# Altium schematic sheet Top_Level.SchDoc (part 1 of 2)
size 1651 x 1270 mm
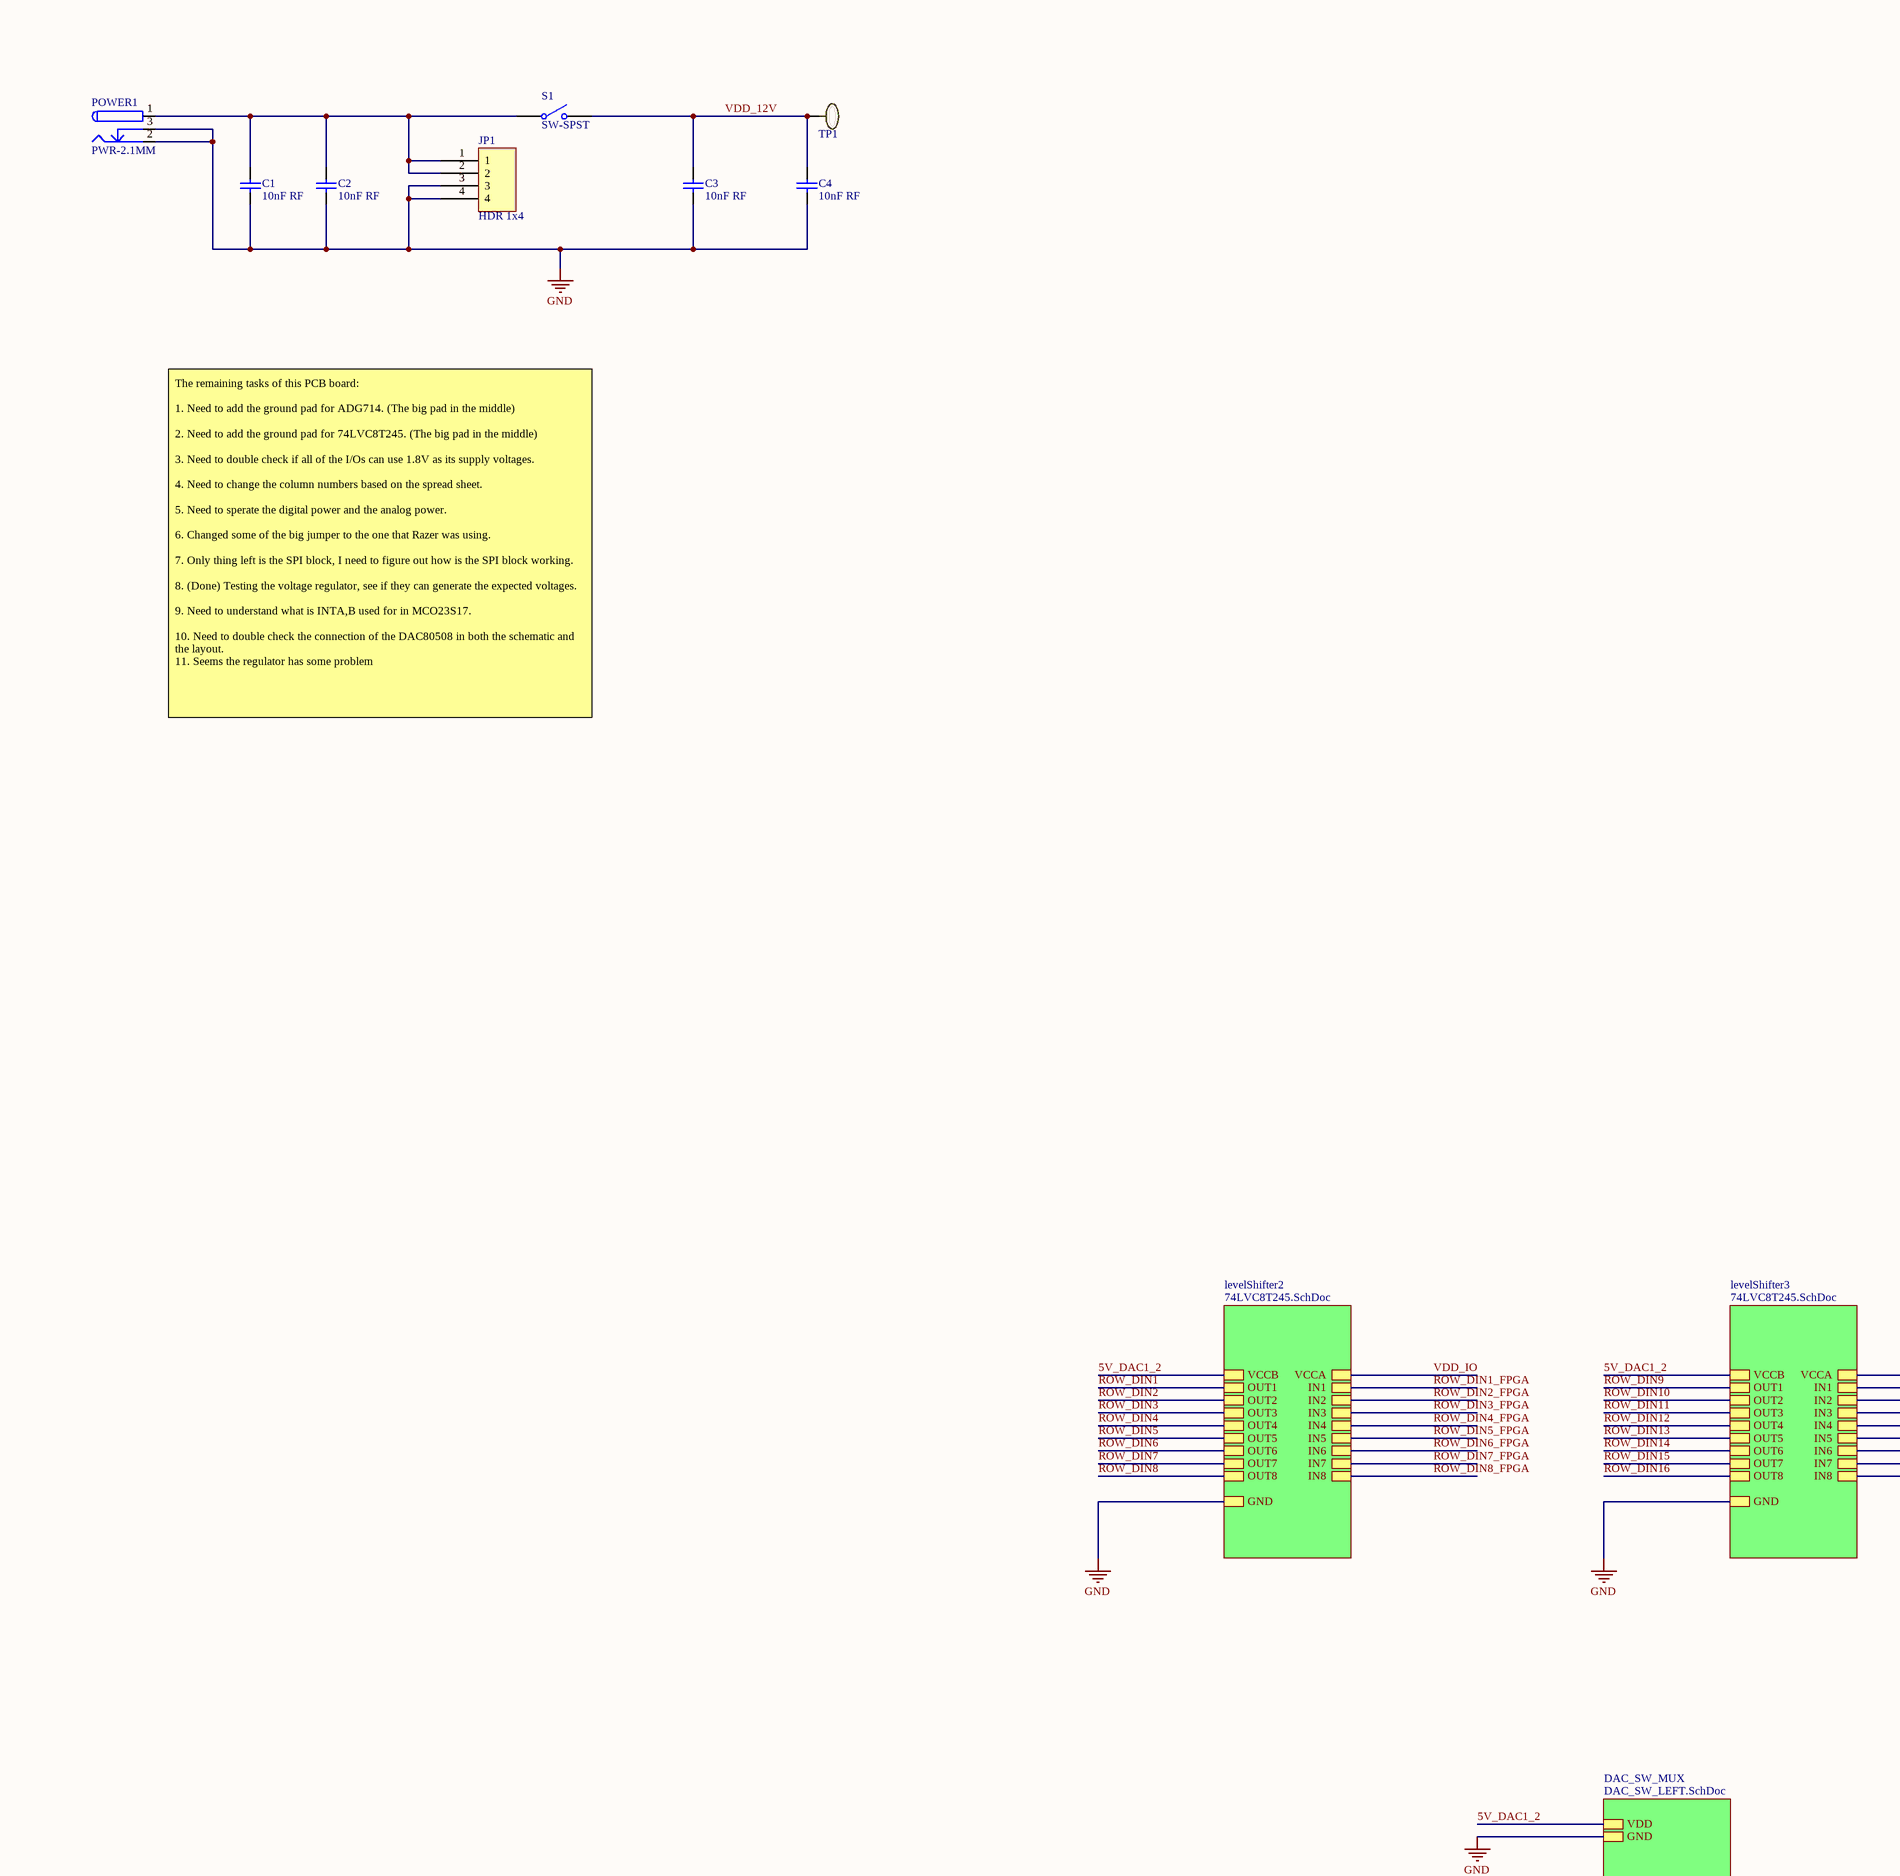
[diagram p0: Top_Level.SchDoc, top column 1 of 4]
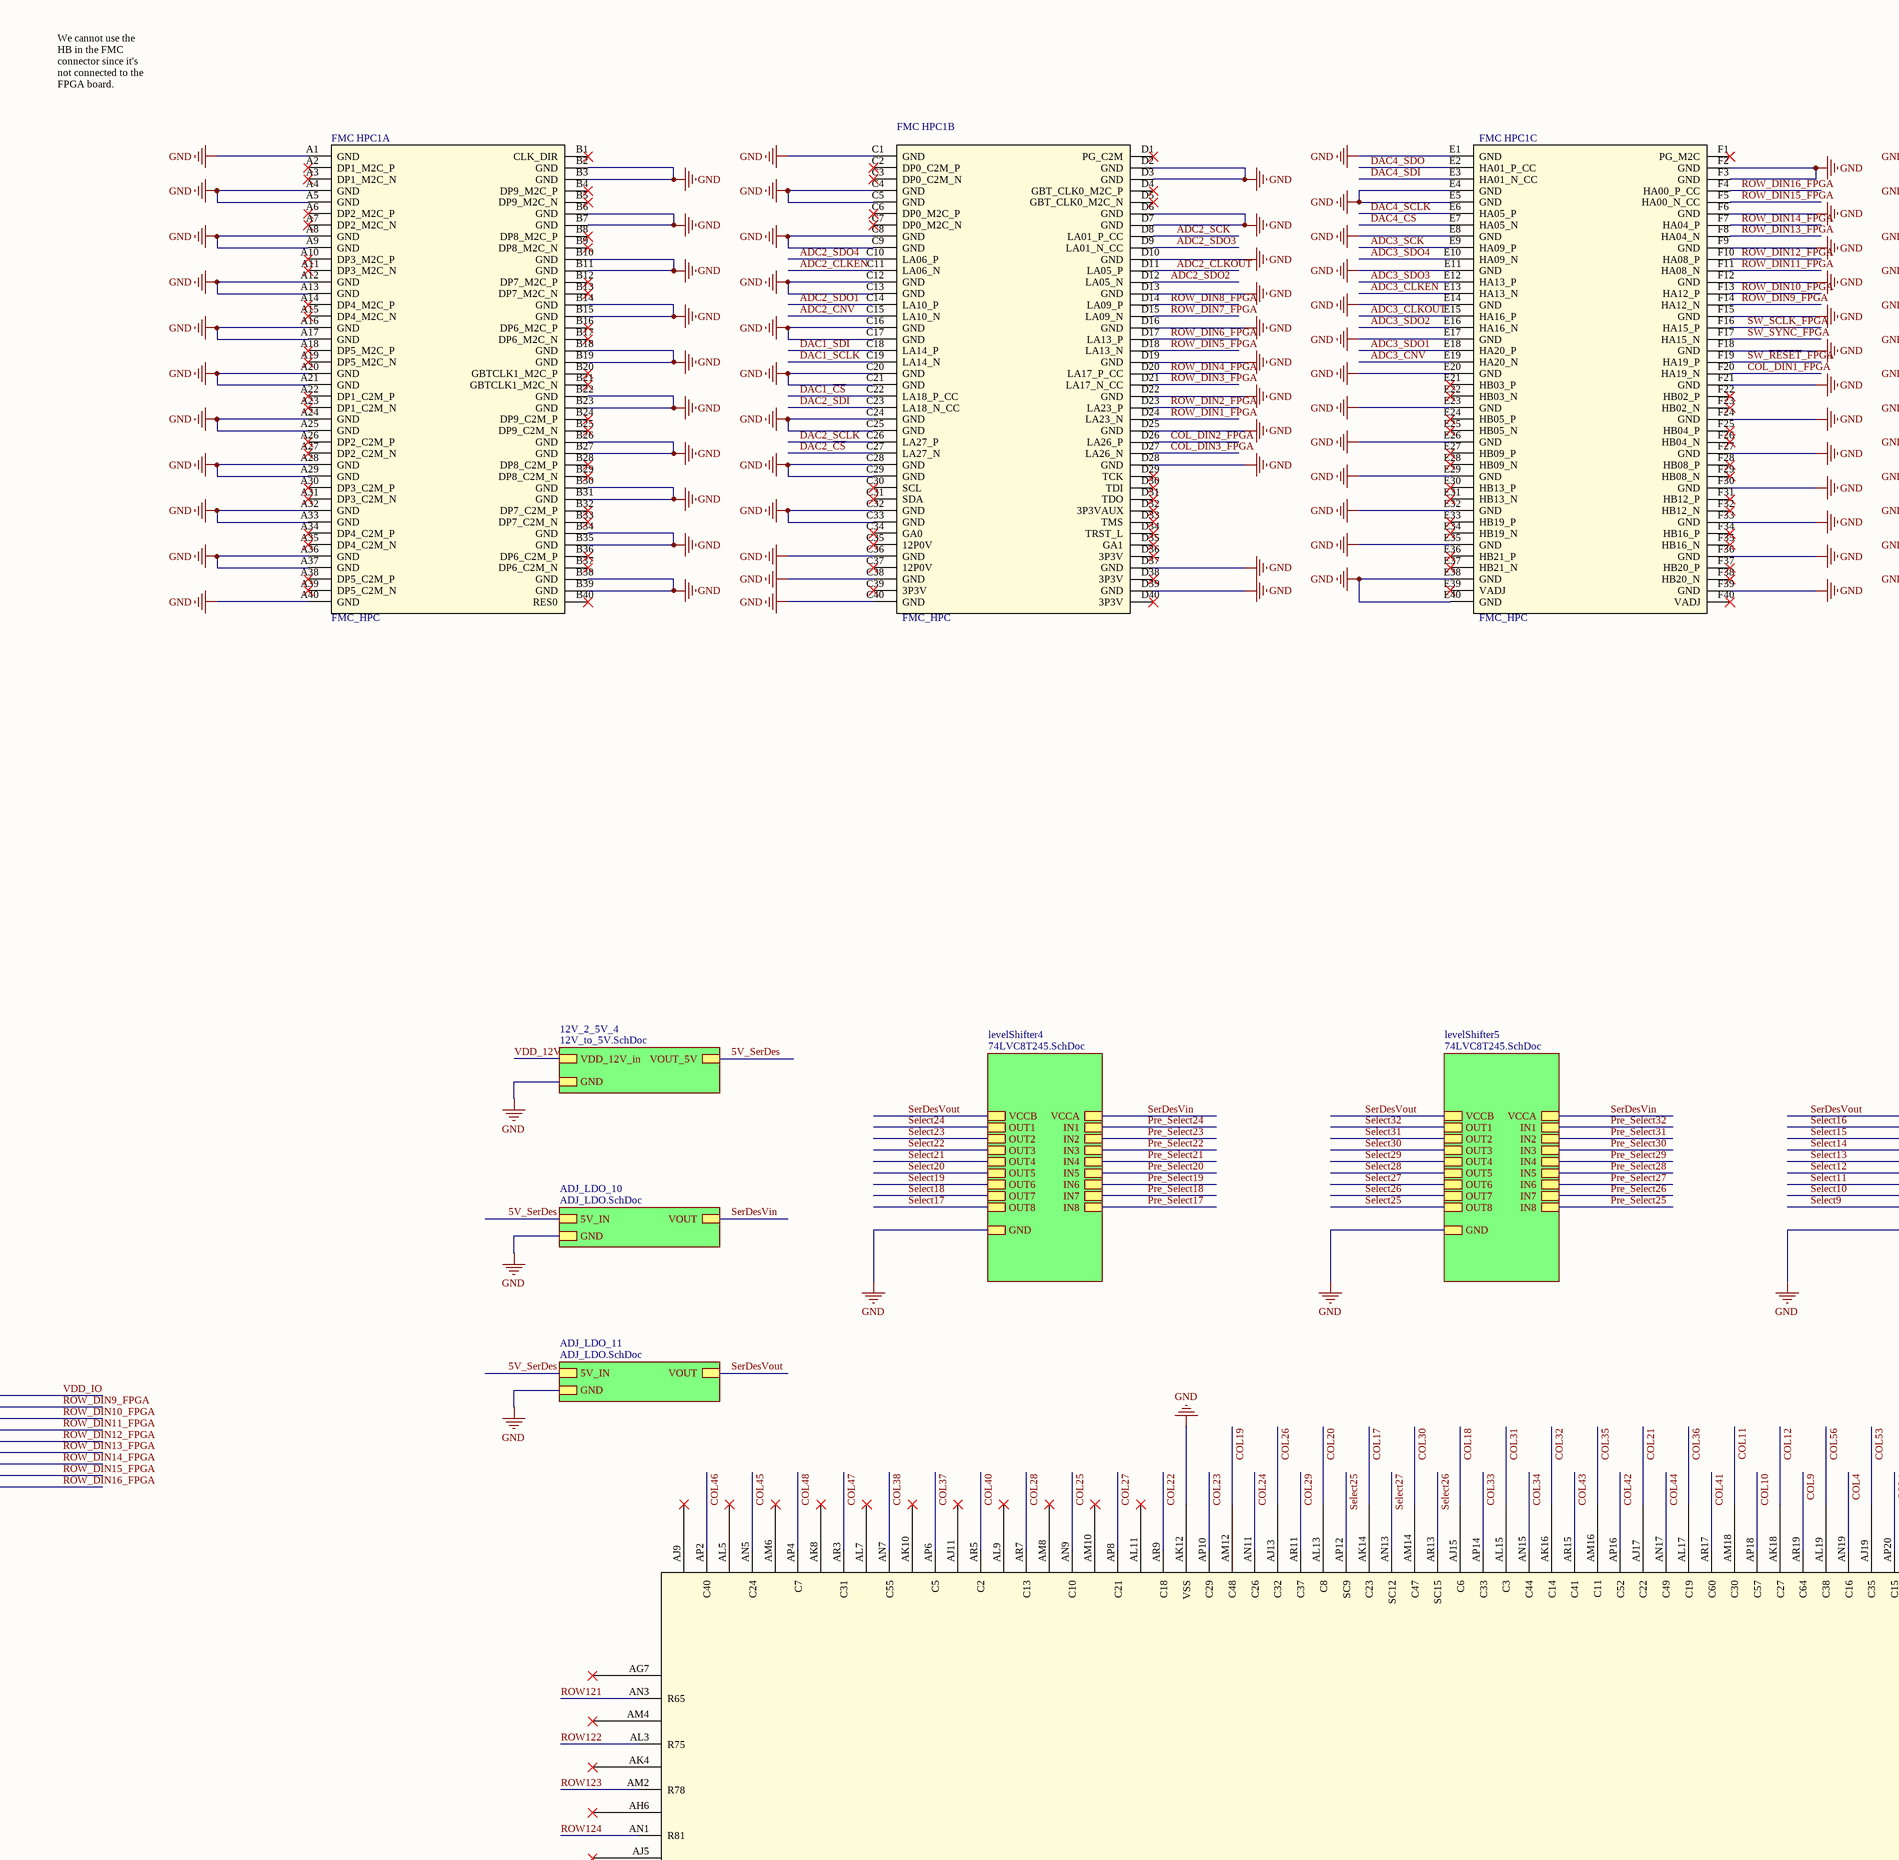
[diagram p1: Top_Level.SchDoc, top column 2 of 4]
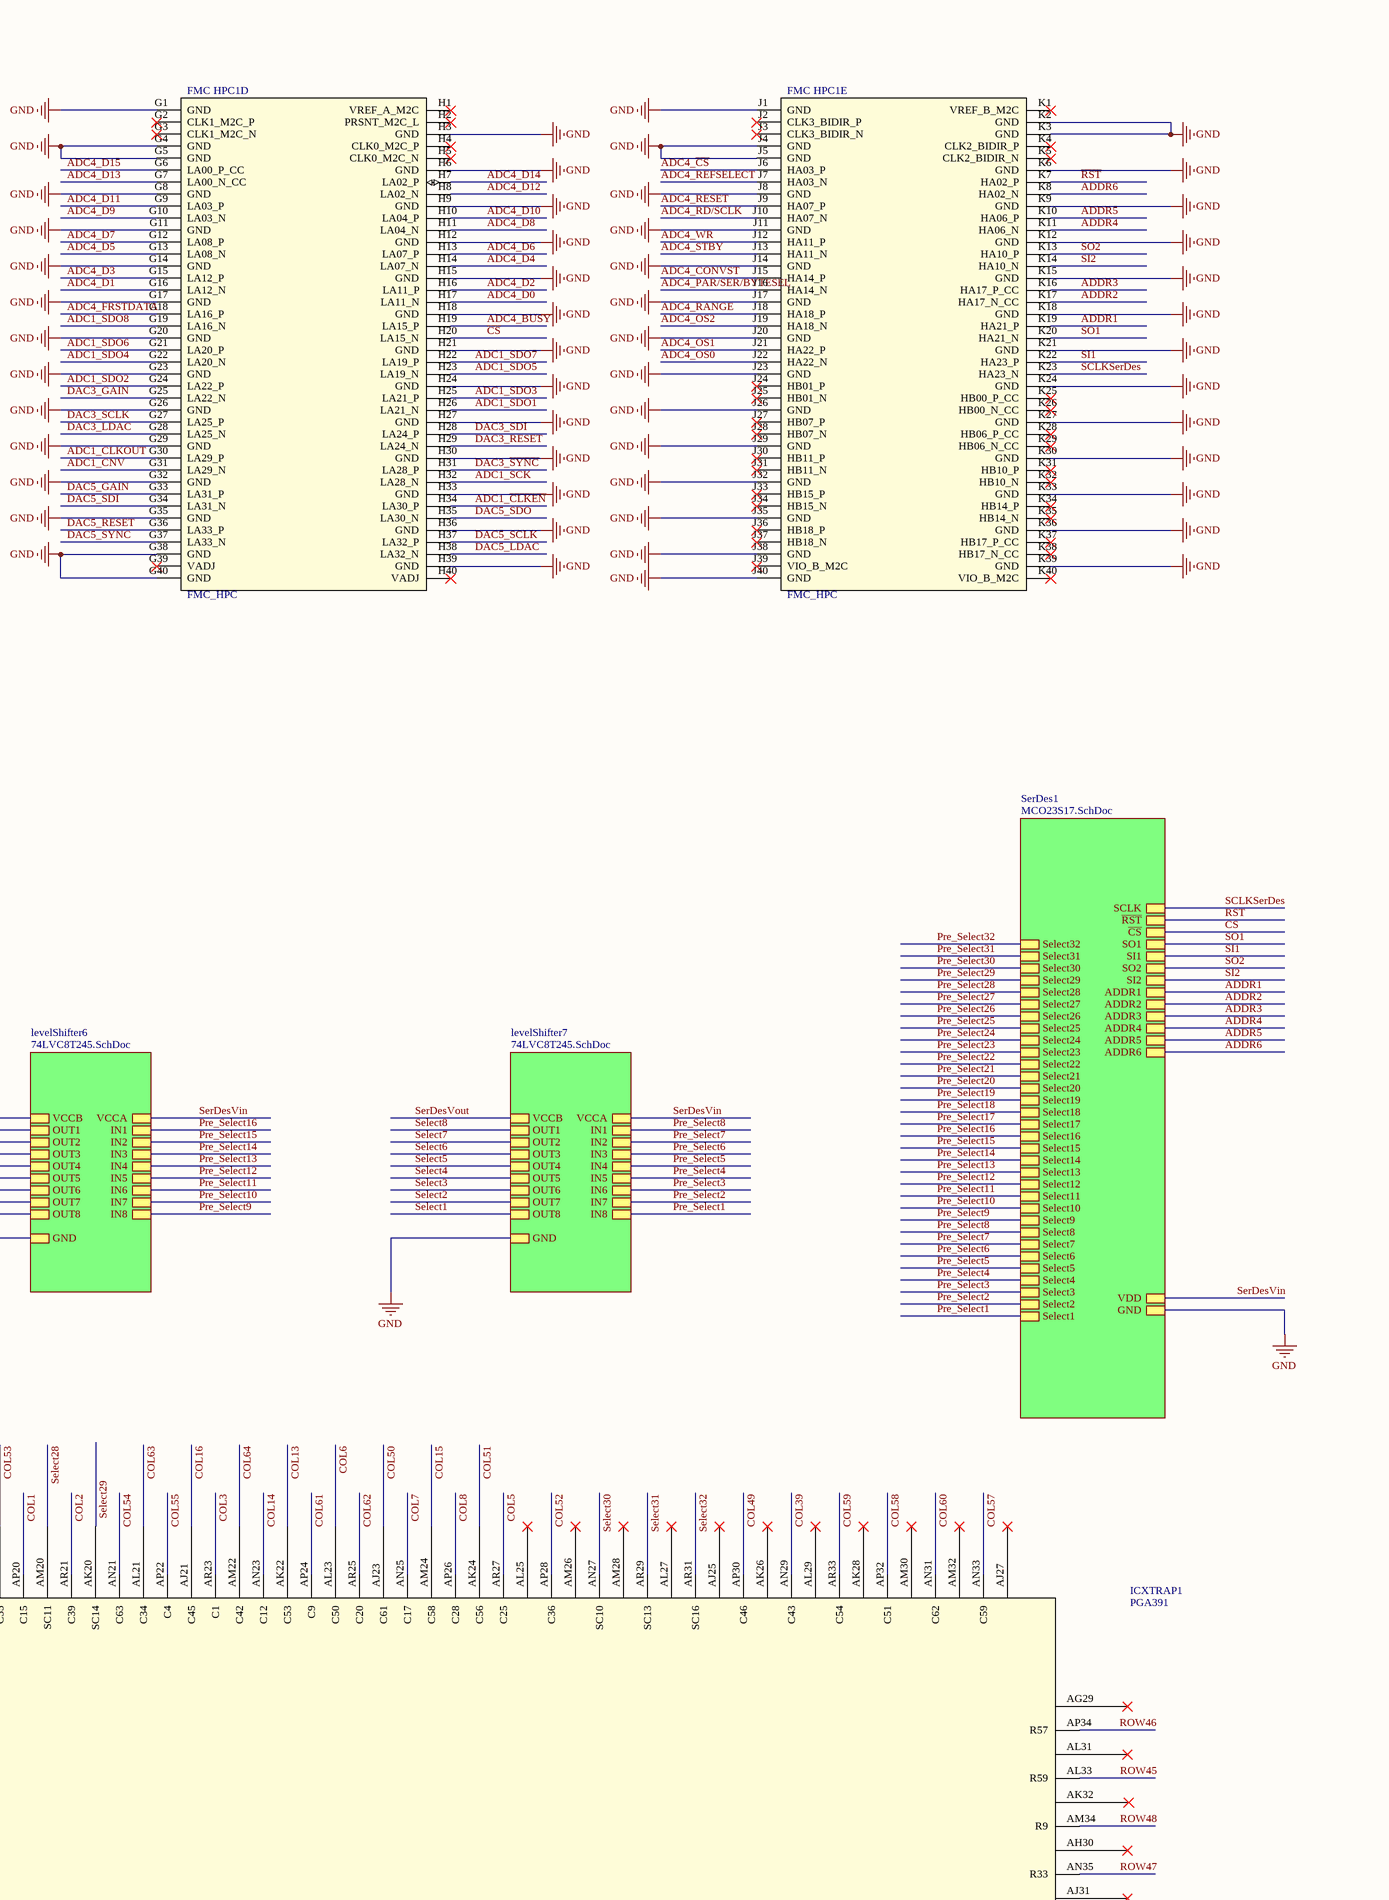
[diagram p2: Top_Level.SchDoc, top column 3 of 4]
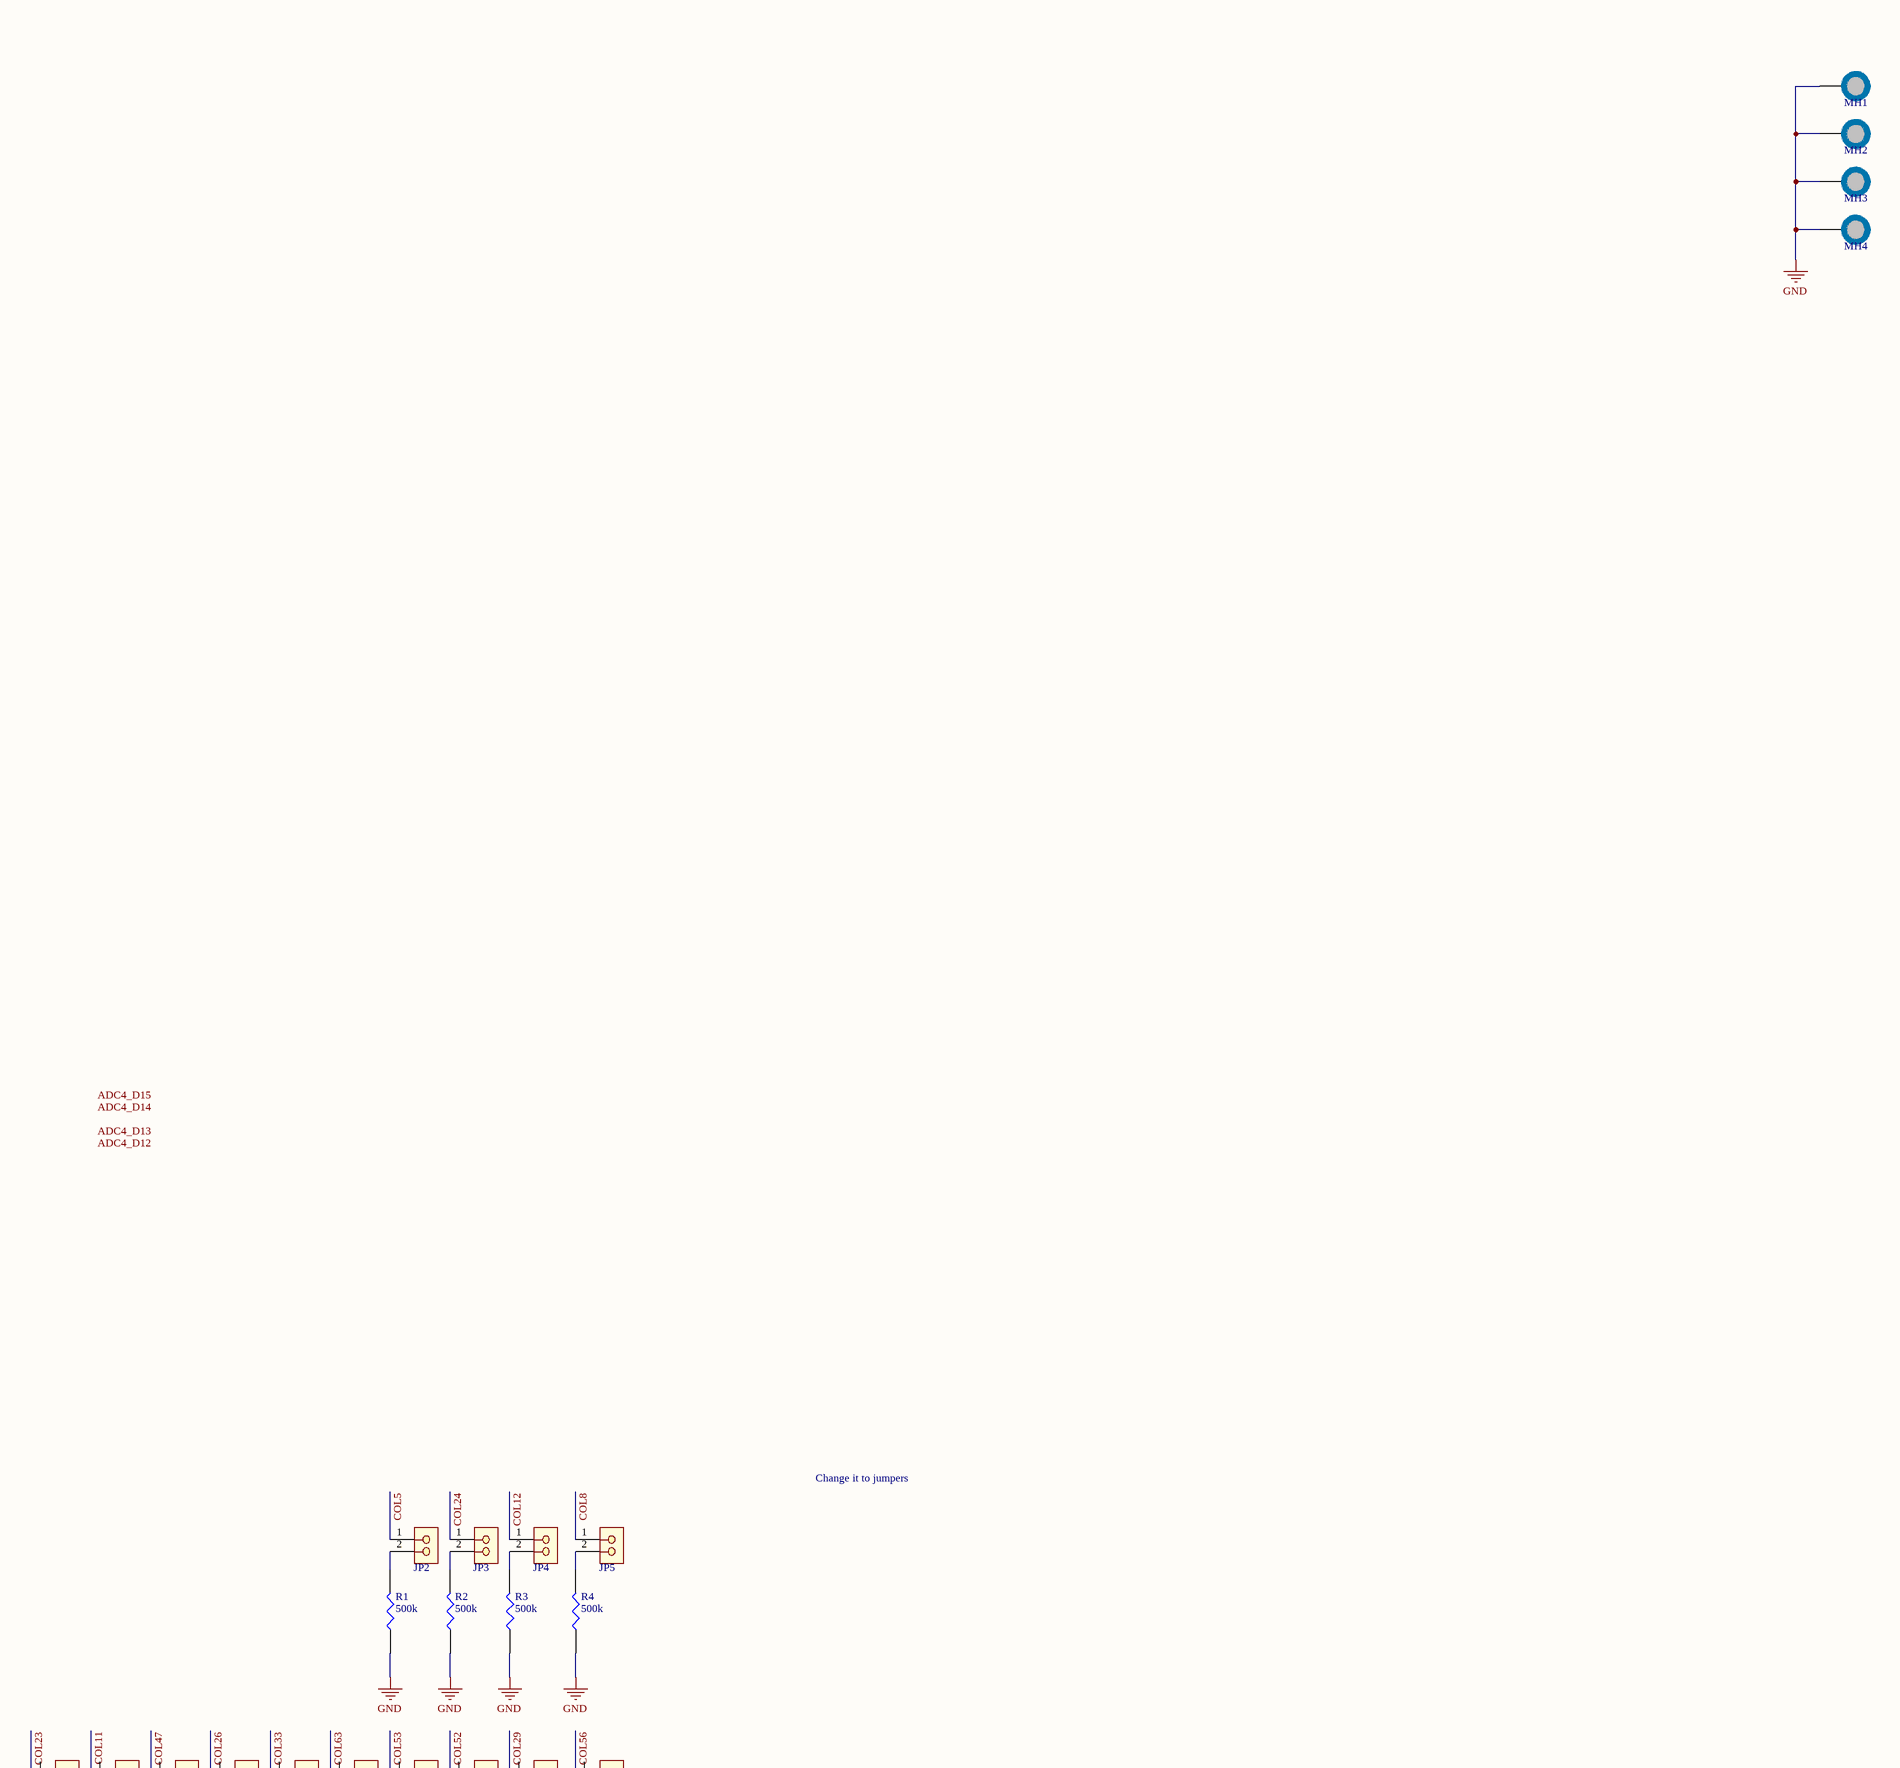
[diagram p3: Top_Level.SchDoc, top column 4 of 4]
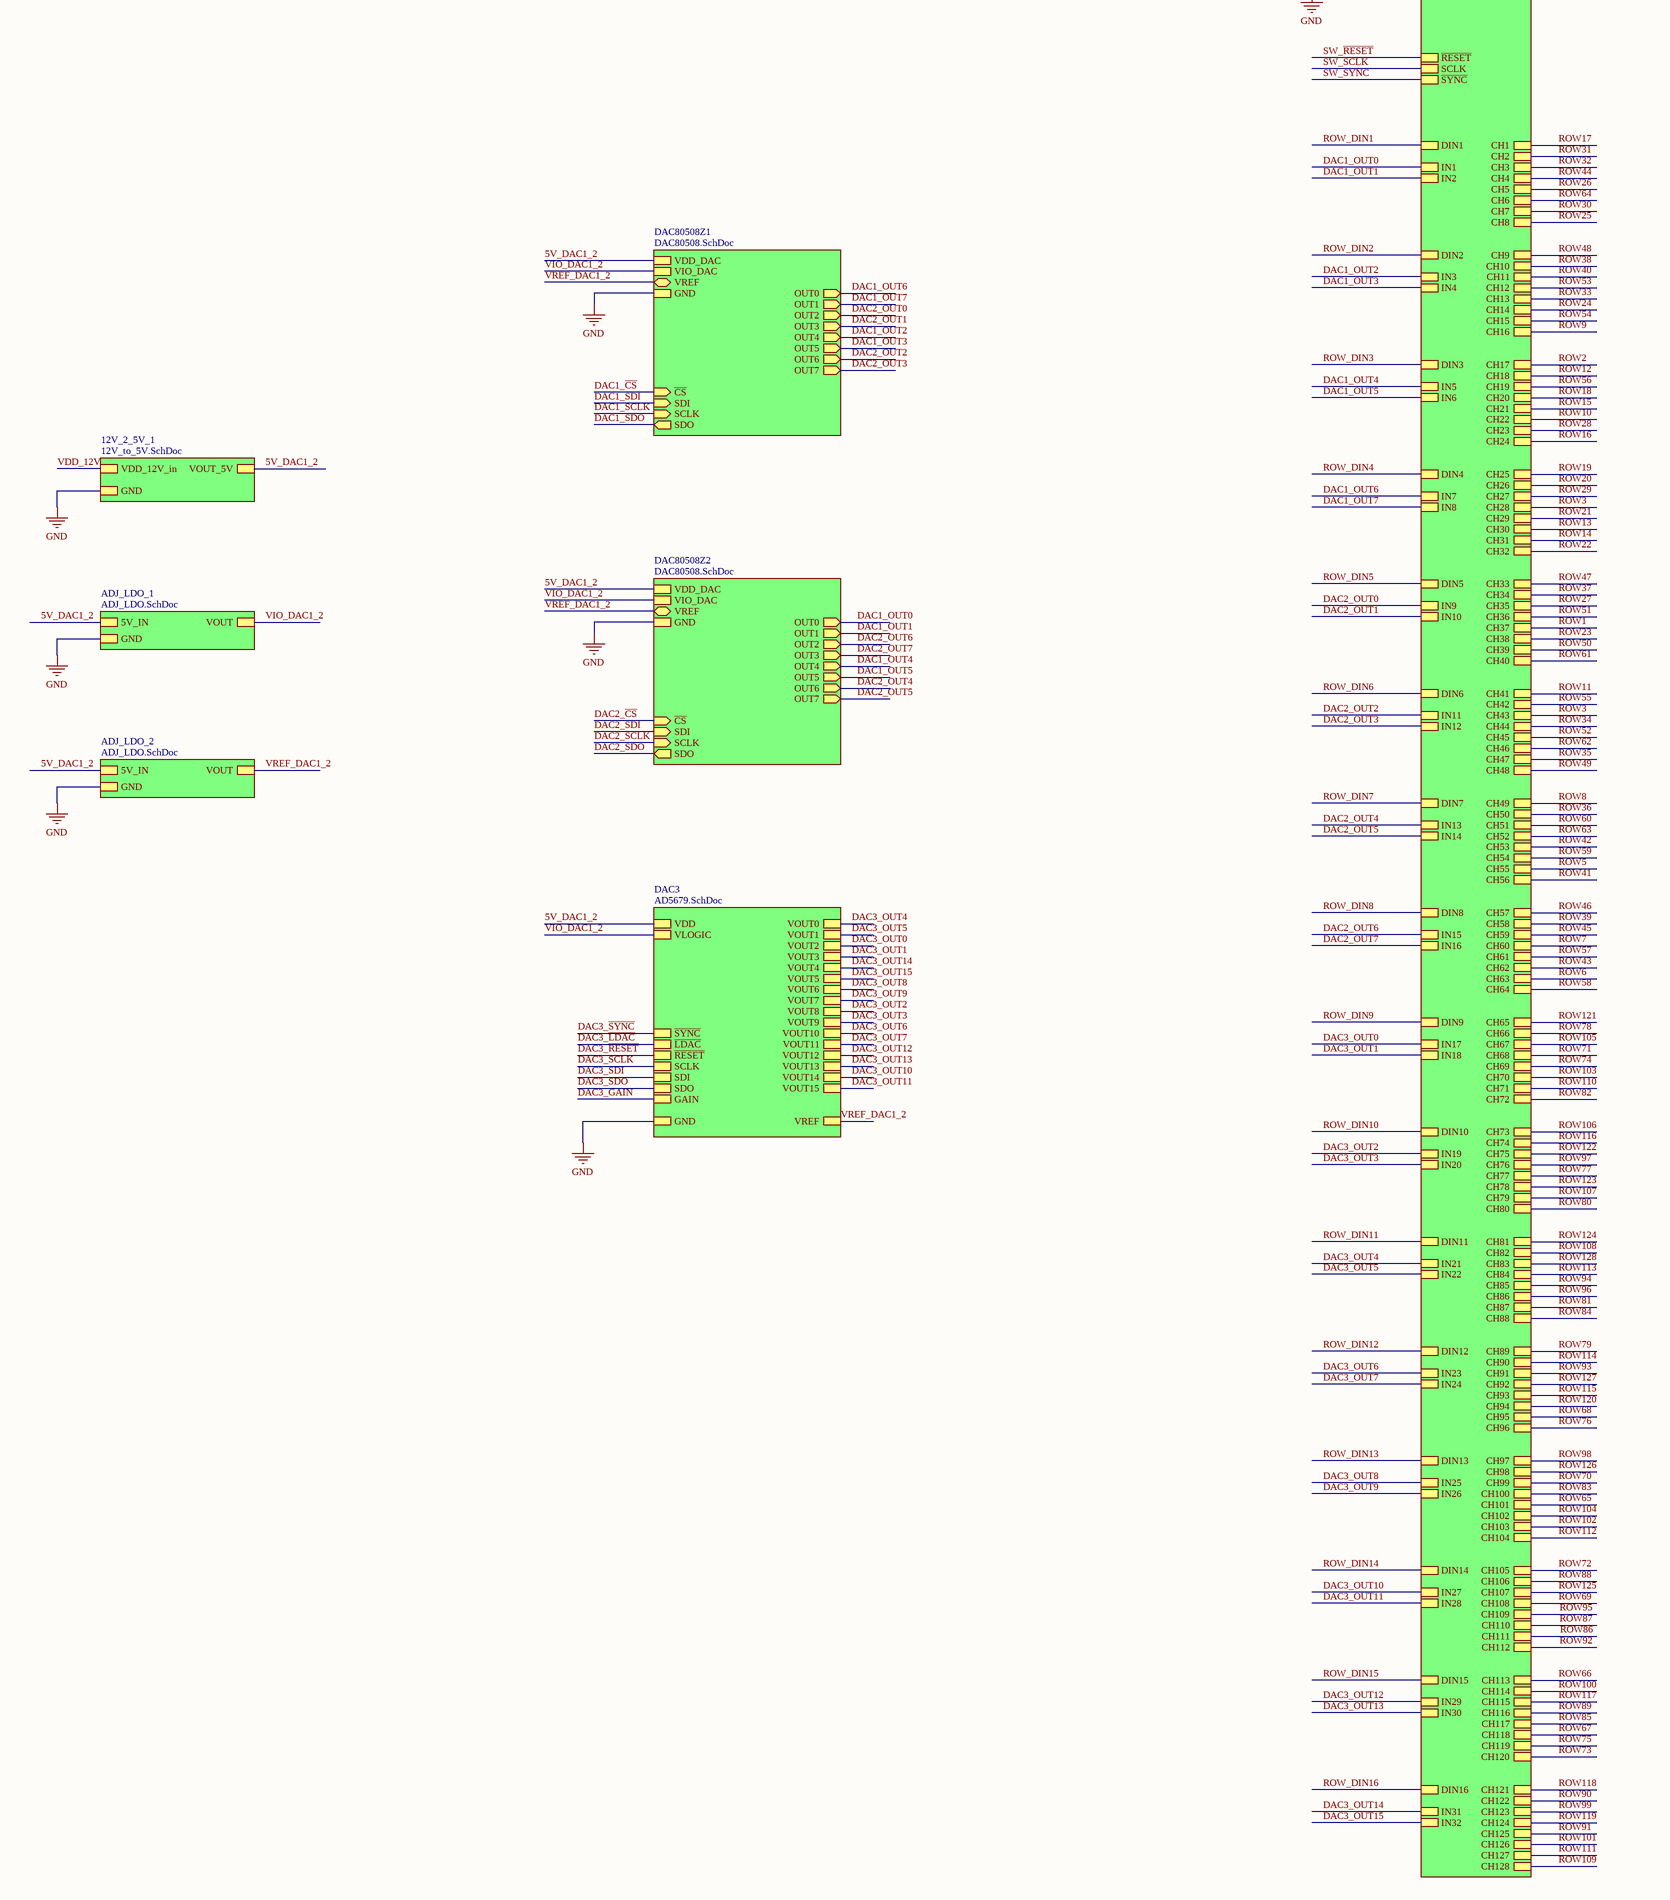
[diagram p4: Top_Level.SchDoc, centre column 1 of 4]
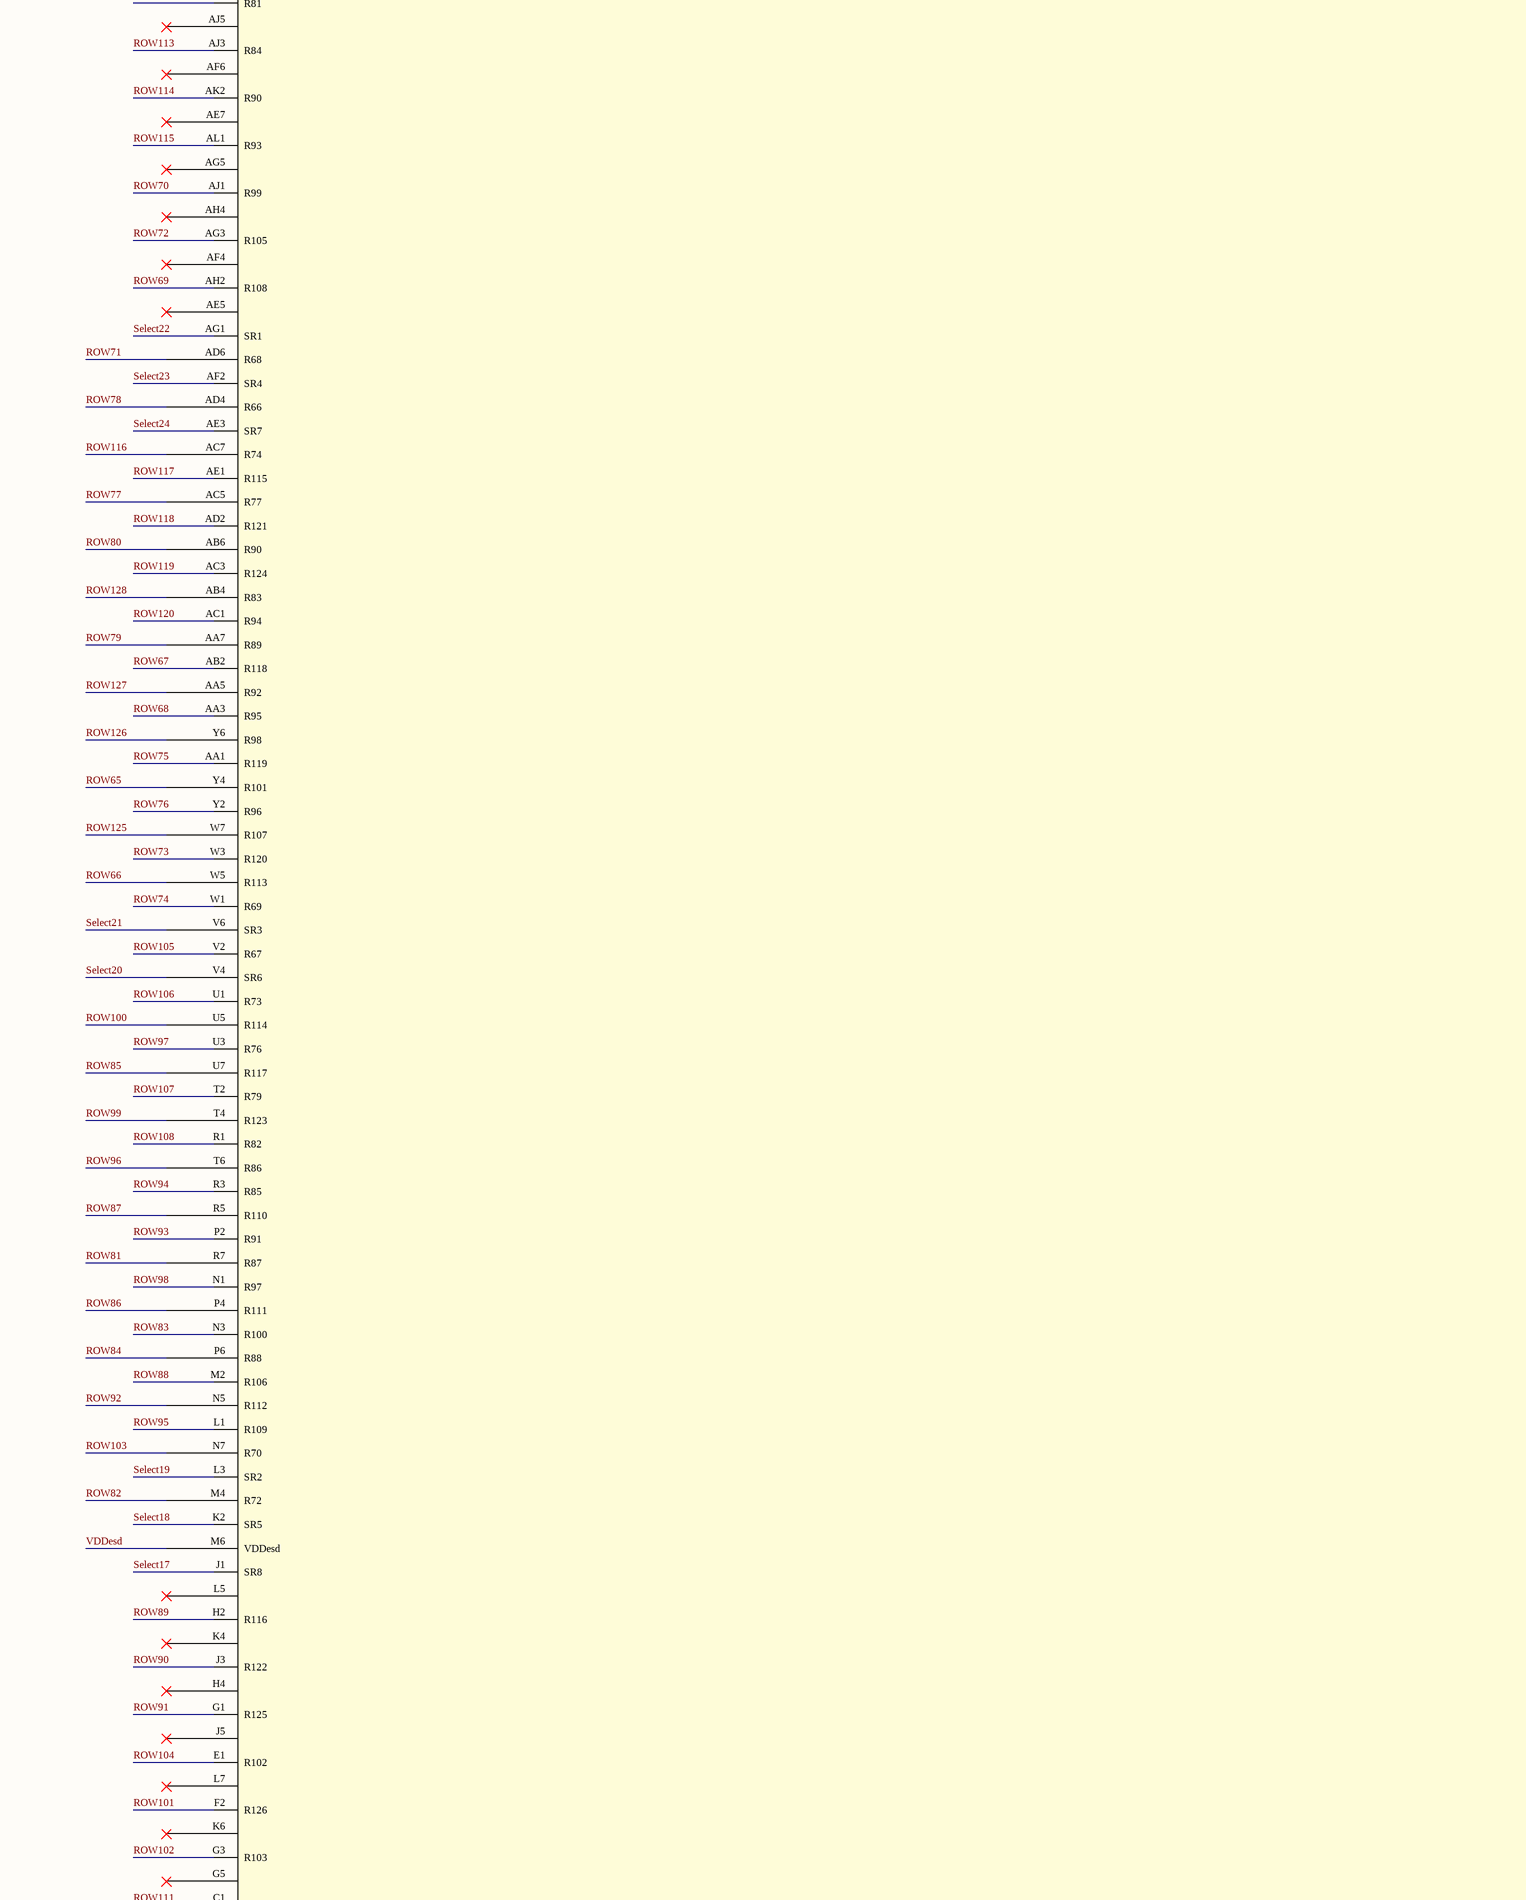
[diagram p5: Top_Level.SchDoc, centre column 2 of 4]
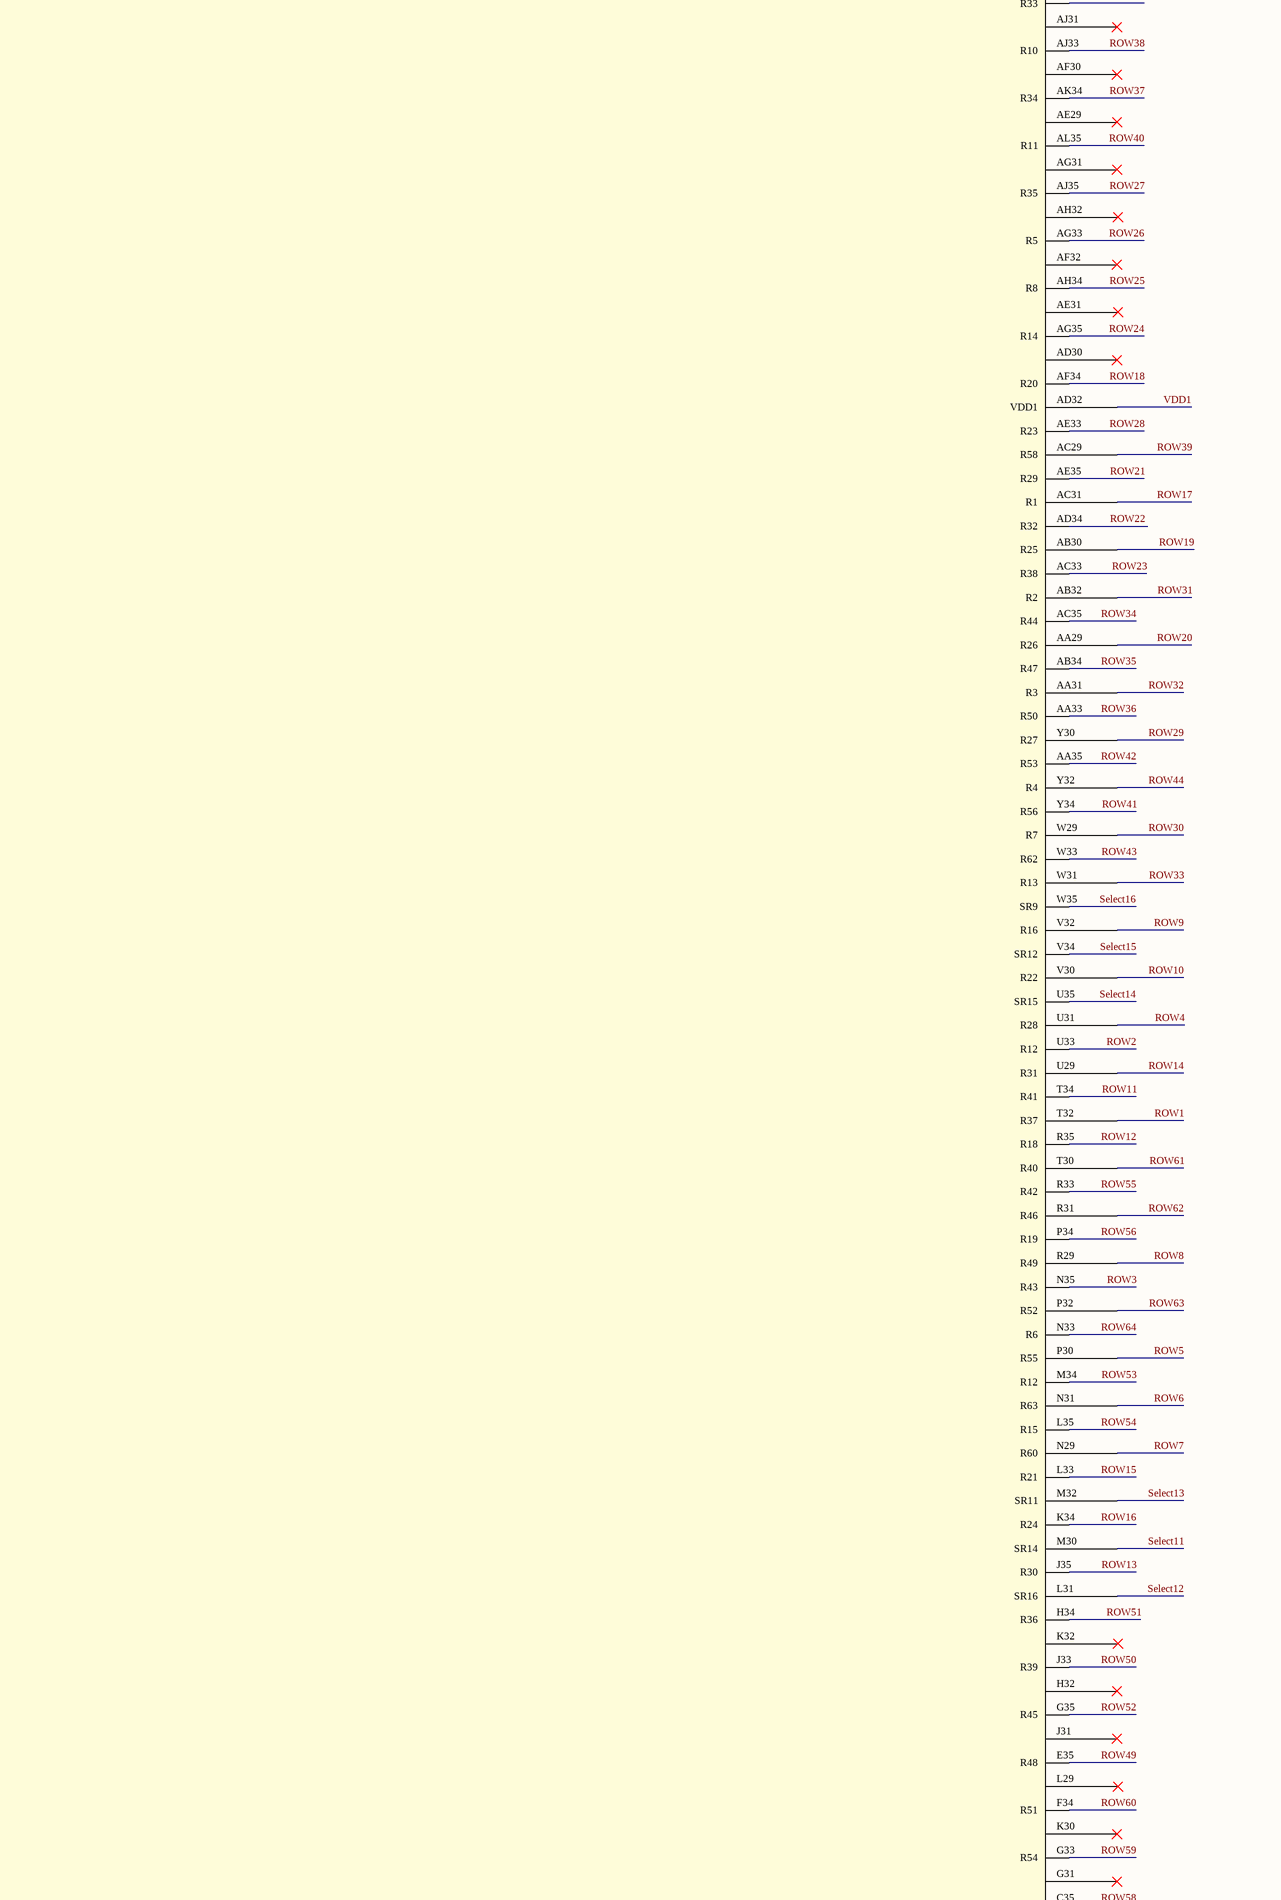
[diagram p6: Top_Level.SchDoc, centre column 3 of 4]
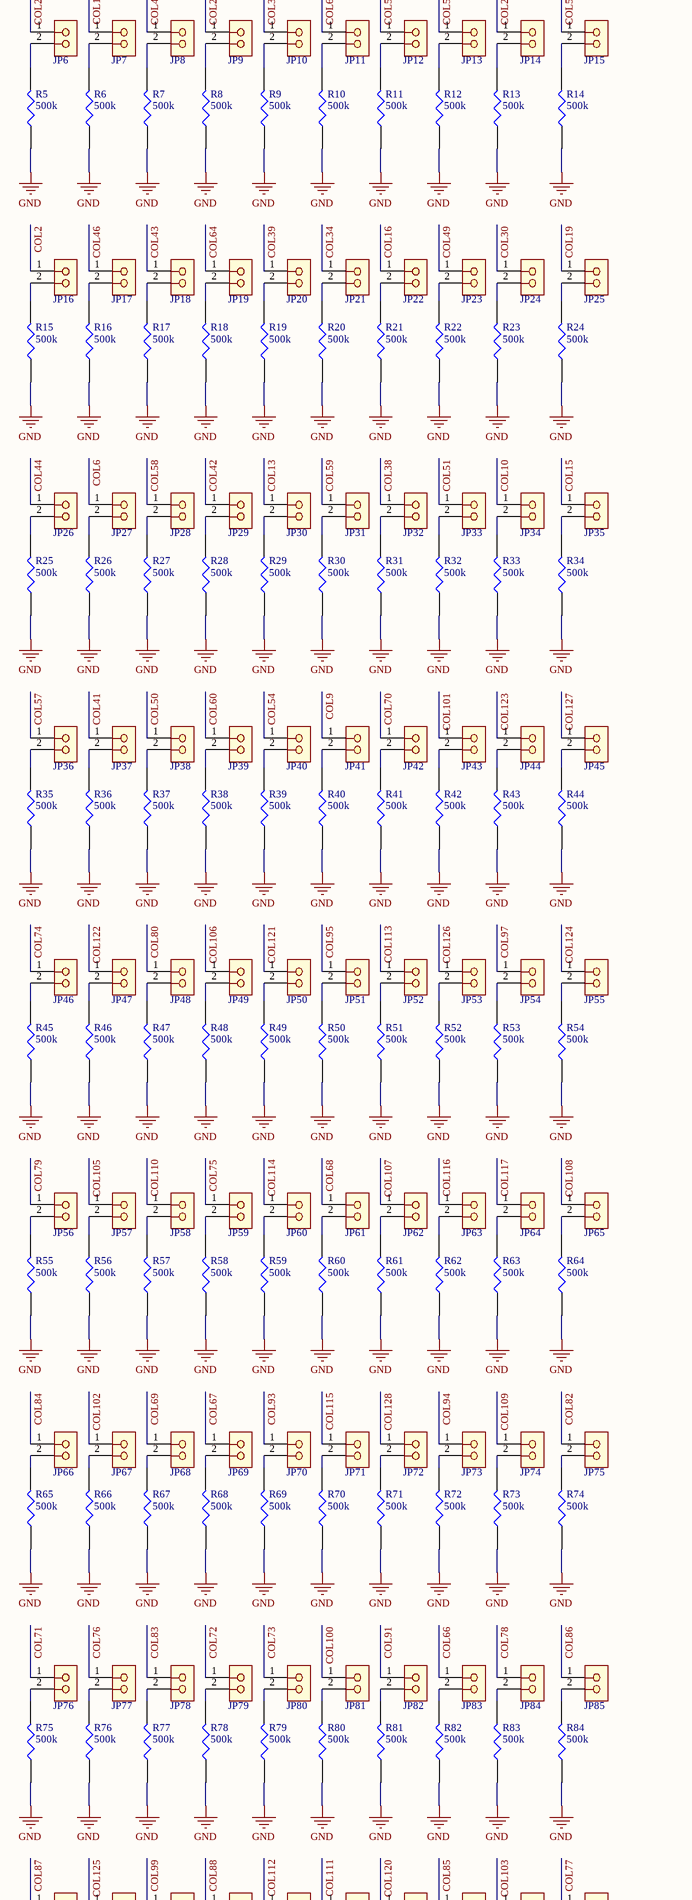
[diagram p7: Top_Level.SchDoc, centre column 4 of 4]
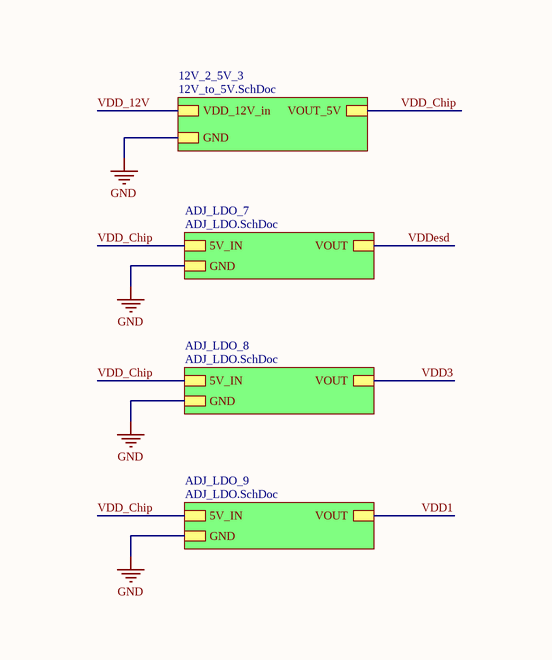
[diagram p8: Top_Level.SchDoc, bottom column 1 of 4]
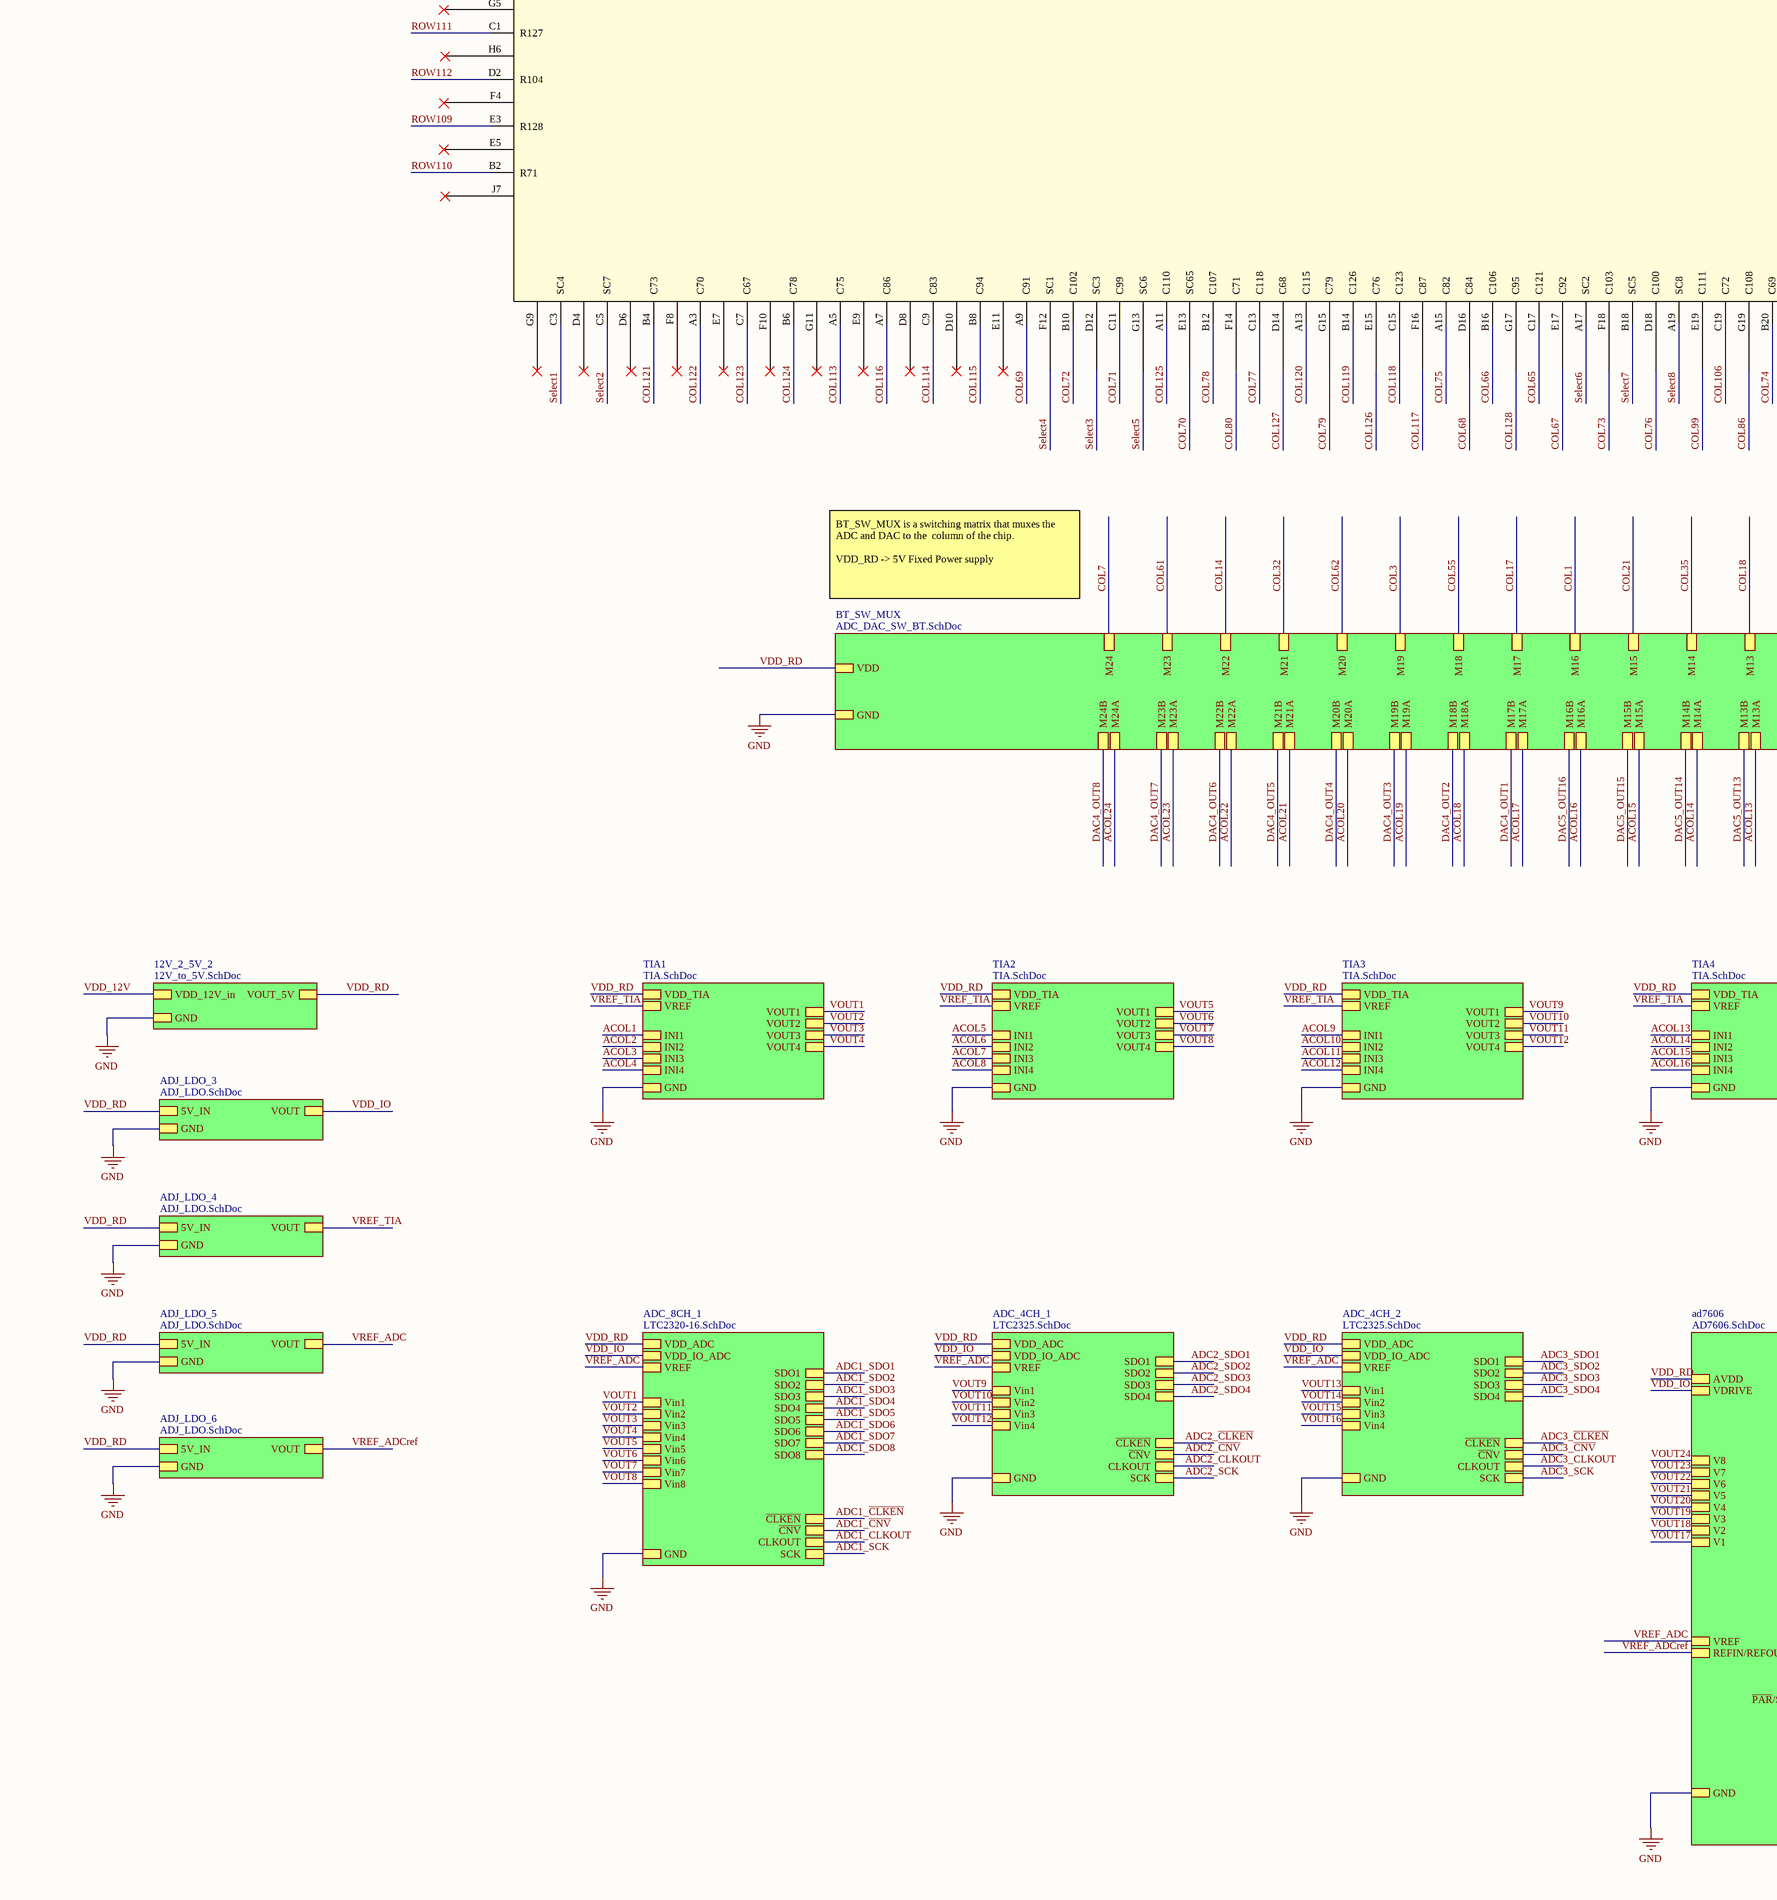
[diagram p9: Top_Level.SchDoc, bottom column 2 of 4]
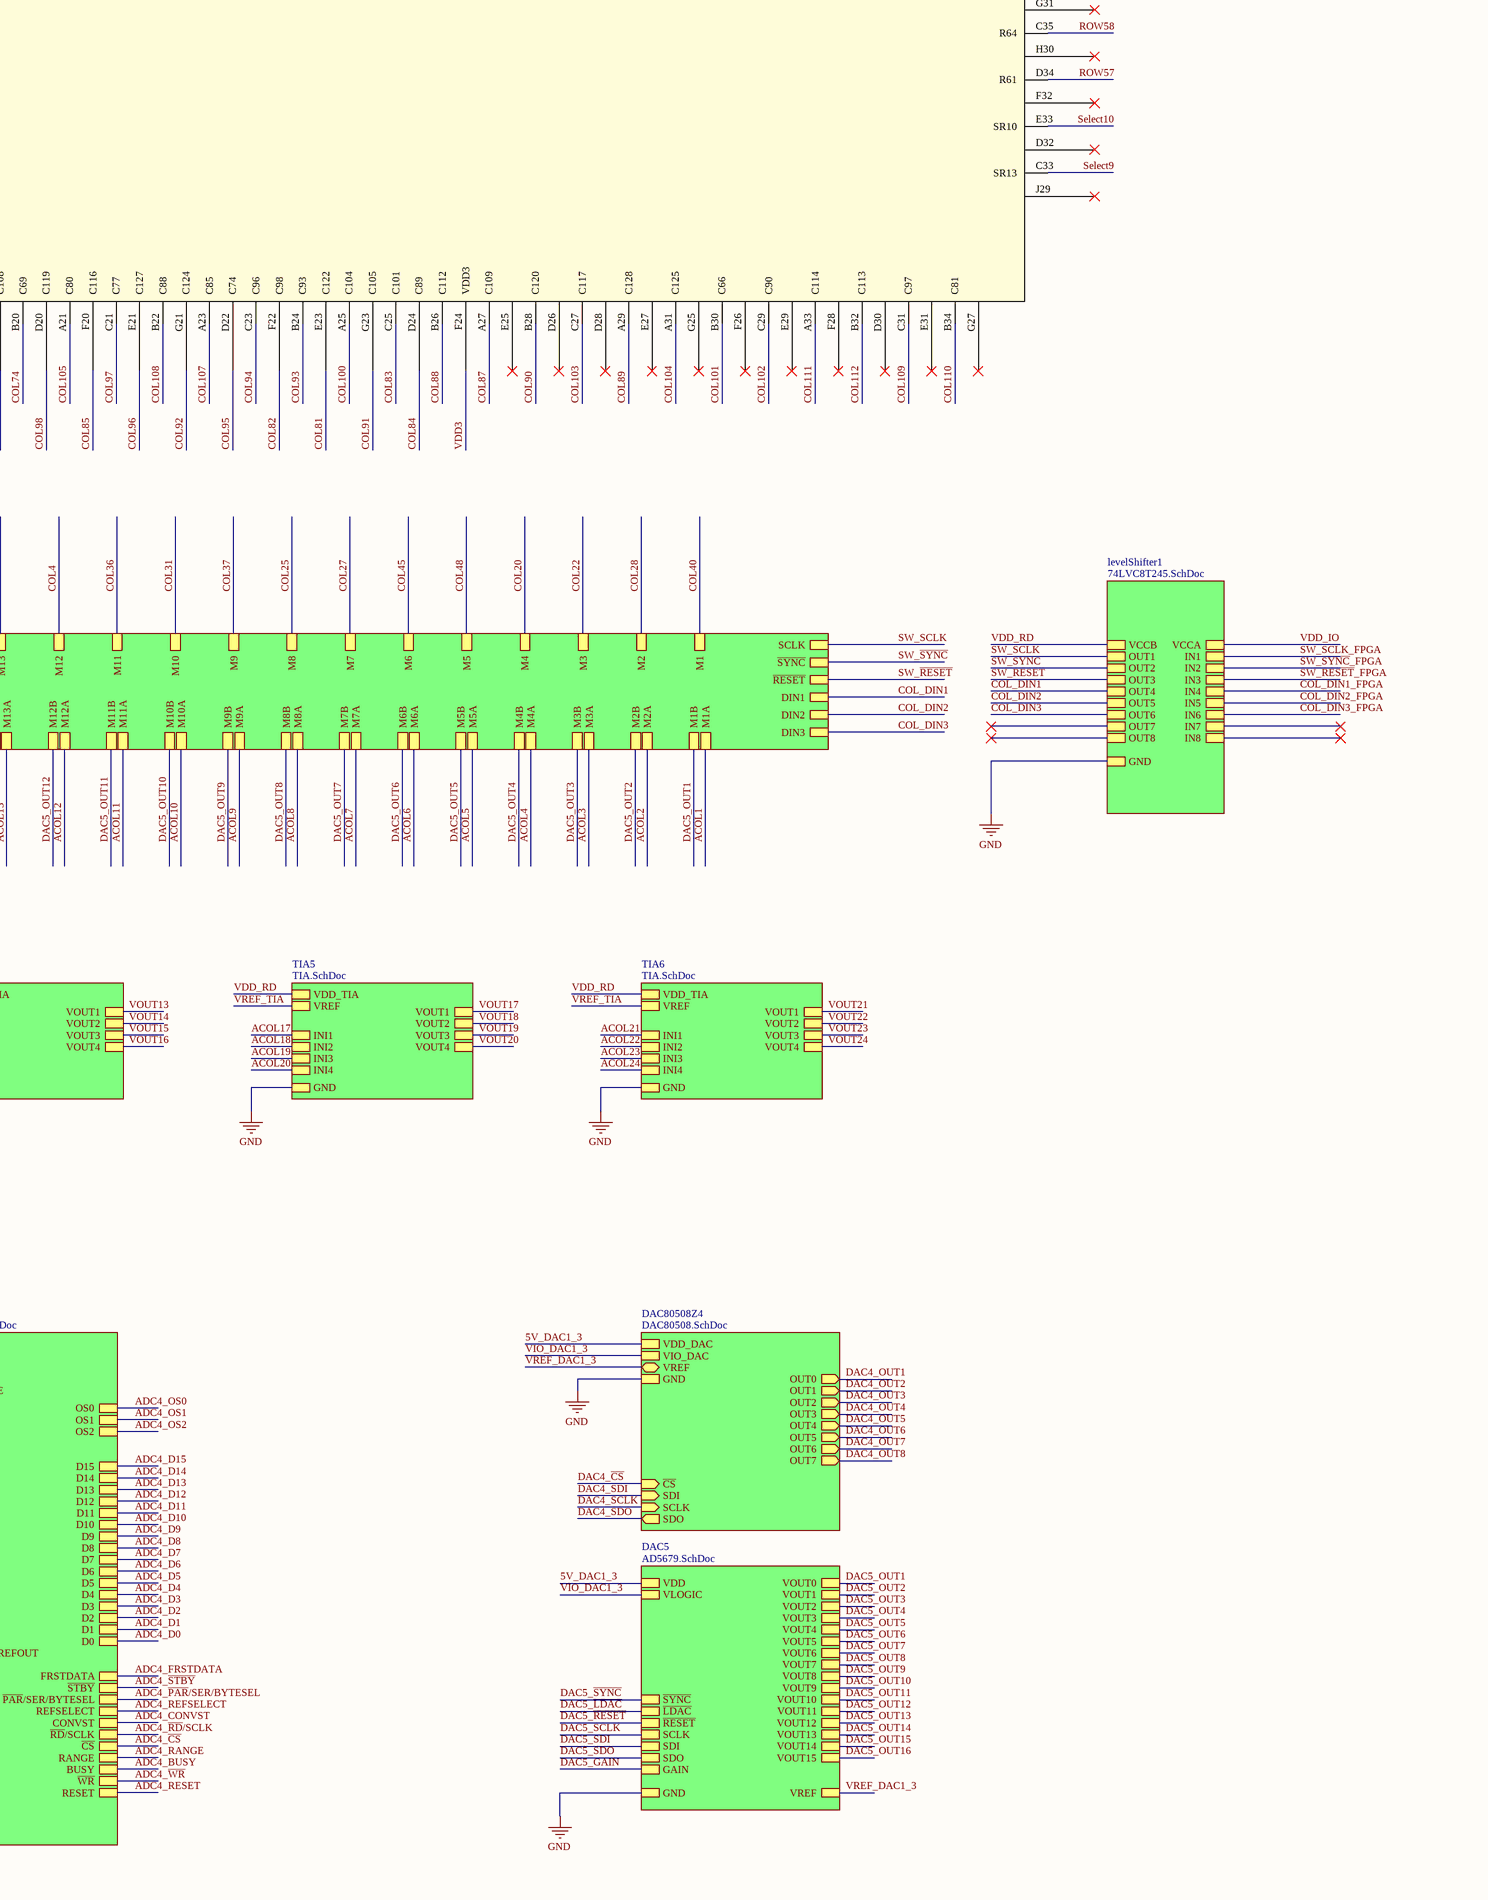
[diagram p10: Top_Level.SchDoc, bottom column 3 of 4]
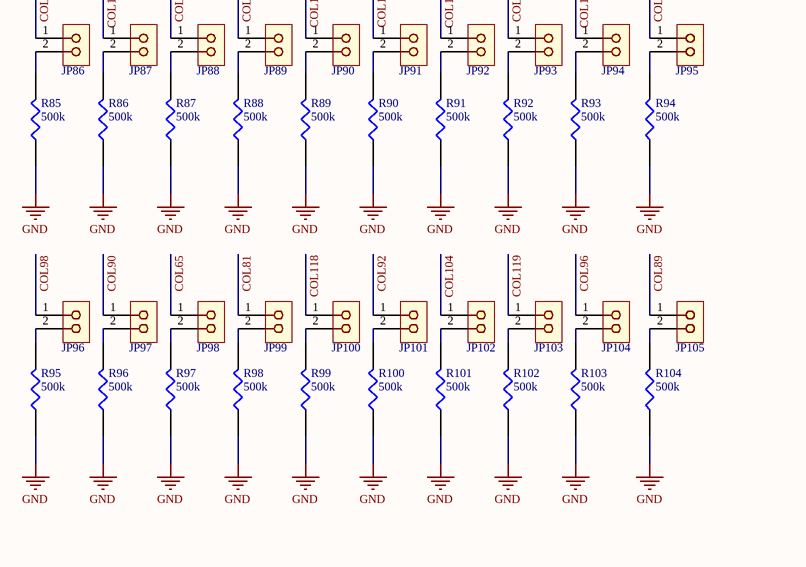
[diagram p11: Top_Level.SchDoc, bottom column 4 of 4]

## Parts
C1  10nF RF  [C0805]
C2  10nF RF  [C0805]
C3  10nF RF  [C0805]
C4  10nF RF  [C0805]
FMC_HPC1  FMC_HPC  [FMC_HPC]  (parts A,B,C,D,E of 5)
ICXTRAP1  PGA391  [PGA391]
JP1  HDR 1x4  [Hdr_1x4_2.54mm]
JP2  01x02  [01x02_0.1in_th_straight_b_nom]  (value not drawn)
JP3  01x02  [01x02_0.1in_th_straight_b_nom]  (value not drawn)
JP4  01x02  [01x02_0.1in_th_straight_b_nom]  (value not drawn)
JP5  01x02  [01x02_0.1in_th_straight_b_nom]  (value not drawn)
JP6  01x02  [01x02_0.1in_th_straight_b_nom]  (value not drawn)
JP7  01x02  [01x02_0.1in_th_straight_b_nom]  (value not drawn)
JP8  01x02  [01x02_0.1in_th_straight_b_nom]  (value not drawn)
JP9  01x02  [01x02_0.1in_th_straight_b_nom]  (value not drawn)
JP10  01x02  [01x02_0.1in_th_straight_b_nom]  (value not drawn)
JP11  01x02  [01x02_0.1in_th_straight_b_nom]  (value not drawn)
JP12  01x02  [01x02_0.1in_th_straight_b_nom]  (value not drawn)
JP13  01x02  [01x02_0.1in_th_straight_b_nom]  (value not drawn)
JP14  01x02  [01x02_0.1in_th_straight_b_nom]  (value not drawn)
JP15  01x02  [01x02_0.1in_th_straight_b_nom]  (value not drawn)
JP16  01x02  [01x02_0.1in_th_straight_b_nom]  (value not drawn)
JP17  01x02  [01x02_0.1in_th_straight_b_nom]  (value not drawn)
JP18  01x02  [01x02_0.1in_th_straight_b_nom]  (value not drawn)
JP19  01x02  [01x02_0.1in_th_straight_b_nom]  (value not drawn)
JP20  01x02  [01x02_0.1in_th_straight_b_nom]  (value not drawn)
JP21  01x02  [01x02_0.1in_th_straight_b_nom]  (value not drawn)
JP22  01x02  [01x02_0.1in_th_straight_b_nom]  (value not drawn)
JP23  01x02  [01x02_0.1in_th_straight_b_nom]  (value not drawn)
JP24  01x02  [01x02_0.1in_th_straight_b_nom]  (value not drawn)
JP25  01x02  [01x02_0.1in_th_straight_b_nom]  (value not drawn)
JP26  01x02  [01x02_0.1in_th_straight_b_nom]  (value not drawn)
JP27  01x02  [01x02_0.1in_th_straight_b_nom]  (value not drawn)
JP28  01x02  [01x02_0.1in_th_straight_b_nom]  (value not drawn)
JP29  01x02  [01x02_0.1in_th_straight_b_nom]  (value not drawn)
JP30  01x02  [01x02_0.1in_th_straight_b_nom]  (value not drawn)
JP31  01x02  [01x02_0.1in_th_straight_b_nom]  (value not drawn)
JP32  01x02  [01x02_0.1in_th_straight_b_nom]  (value not drawn)
JP33  01x02  [01x02_0.1in_th_straight_b_nom]  (value not drawn)
JP34  01x02  [01x02_0.1in_th_straight_b_nom]  (value not drawn)
JP35  01x02  [01x02_0.1in_th_straight_b_nom]  (value not drawn)
JP36  01x02  [01x02_0.1in_th_straight_b_nom]  (value not drawn)
JP37  01x02  [01x02_0.1in_th_straight_b_nom]  (value not drawn)
JP38  01x02  [01x02_0.1in_th_straight_b_nom]  (value not drawn)
JP39  01x02  [01x02_0.1in_th_straight_b_nom]  (value not drawn)
JP40  01x02  [01x02_0.1in_th_straight_b_nom]  (value not drawn)
JP41  01x02  [01x02_0.1in_th_straight_b_nom]  (value not drawn)
JP42  01x02  [01x02_0.1in_th_straight_b_nom]  (value not drawn)
JP43  01x02  [01x02_0.1in_th_straight_b_nom]  (value not drawn)
JP44  01x02  [01x02_0.1in_th_straight_b_nom]  (value not drawn)
JP45  01x02  [01x02_0.1in_th_straight_b_nom]  (value not drawn)
JP46  01x02  [01x02_0.1in_th_straight_b_nom]  (value not drawn)
JP47  01x02  [01x02_0.1in_th_straight_b_nom]  (value not drawn)
JP48  01x02  [01x02_0.1in_th_straight_b_nom]  (value not drawn)
JP49  01x02  [01x02_0.1in_th_straight_b_nom]  (value not drawn)
JP50  01x02  [01x02_0.1in_th_straight_b_nom]  (value not drawn)
JP51  01x02  [01x02_0.1in_th_straight_b_nom]  (value not drawn)
JP52  01x02  [01x02_0.1in_th_straight_b_nom]  (value not drawn)
JP53  01x02  [01x02_0.1in_th_straight_b_nom]  (value not drawn)
JP54  01x02  [01x02_0.1in_th_straight_b_nom]  (value not drawn)
JP55  01x02  [01x02_0.1in_th_straight_b_nom]  (value not drawn)
JP56  01x02  [01x02_0.1in_th_straight_b_nom]  (value not drawn)
JP57  01x02  [01x02_0.1in_th_straight_b_nom]  (value not drawn)
JP58  01x02  [01x02_0.1in_th_straight_b_nom]  (value not drawn)
JP59  01x02  [01x02_0.1in_th_straight_b_nom]  (value not drawn)
JP60  01x02  [01x02_0.1in_th_straight_b_nom]  (value not drawn)
JP61  01x02  [01x02_0.1in_th_straight_b_nom]  (value not drawn)
JP62  01x02  [01x02_0.1in_th_straight_b_nom]  (value not drawn)
JP63  01x02  [01x02_0.1in_th_straight_b_nom]  (value not drawn)
JP64  01x02  [01x02_0.1in_th_straight_b_nom]  (value not drawn)
JP65  01x02  [01x02_0.1in_th_straight_b_nom]  (value not drawn)
JP66  01x02  [01x02_0.1in_th_straight_b_nom]  (value not drawn)
JP67  01x02  [01x02_0.1in_th_straight_b_nom]  (value not drawn)
JP68  01x02  [01x02_0.1in_th_straight_b_nom]  (value not drawn)
JP69  01x02  [01x02_0.1in_th_straight_b_nom]  (value not drawn)
JP70  01x02  [01x02_0.1in_th_straight_b_nom]  (value not drawn)
JP71  01x02  [01x02_0.1in_th_straight_b_nom]  (value not drawn)
JP72  01x02  [01x02_0.1in_th_straight_b_nom]  (value not drawn)
JP73  01x02  [01x02_0.1in_th_straight_b_nom]  (value not drawn)
JP74  01x02  [01x02_0.1in_th_straight_b_nom]  (value not drawn)
JP75  01x02  [01x02_0.1in_th_straight_b_nom]  (value not drawn)
JP76  01x02  [01x02_0.1in_th_straight_b_nom]  (value not drawn)
JP77  01x02  [01x02_0.1in_th_straight_b_nom]  (value not drawn)
JP78  01x02  [01x02_0.1in_th_straight_b_nom]  (value not drawn)
JP79  01x02  [01x02_0.1in_th_straight_b_nom]  (value not drawn)
JP80  01x02  [01x02_0.1in_th_straight_b_nom]  (value not drawn)
JP81  01x02  [01x02_0.1in_th_straight_b_nom]  (value not drawn)
JP82  01x02  [01x02_0.1in_th_straight_b_nom]  (value not drawn)
JP83  01x02  [01x02_0.1in_th_straight_b_nom]  (value not drawn)
JP84  01x02  [01x02_0.1in_th_straight_b_nom]  (value not drawn)
JP85  01x02  [01x02_0.1in_th_straight_b_nom]  (value not drawn)
JP86  01x02  [01x02_0.1in_th_straight_b_nom]  (value not drawn)
JP87  01x02  [01x02_0.1in_th_straight_b_nom]  (value not drawn)
JP88  01x02  [01x02_0.1in_th_straight_b_nom]  (value not drawn)
JP89  01x02  [01x02_0.1in_th_straight_b_nom]  (value not drawn)
JP90  01x02  [01x02_0.1in_th_straight_b_nom]  (value not drawn)
JP91  01x02  [01x02_0.1in_th_straight_b_nom]  (value not drawn)
JP92  01x02  [01x02_0.1in_th_straight_b_nom]  (value not drawn)
JP93  01x02  [01x02_0.1in_th_straight_b_nom]  (value not drawn)
JP94  01x02  [01x02_0.1in_th_straight_b_nom]  (value not drawn)
JP95  01x02  [01x02_0.1in_th_straight_b_nom]  (value not drawn)
JP96  01x02  [01x02_0.1in_th_straight_b_nom]  (value not drawn)
JP97  01x02  [01x02_0.1in_th_straight_b_nom]  (value not drawn)
JP98  01x02  [01x02_0.1in_th_straight_b_nom]  (value not drawn)
JP99  01x02  [01x02_0.1in_th_straight_b_nom]  (value not drawn)
JP100  01x02  [01x02_0.1in_th_straight_b_nom]  (value not drawn)
JP101  01x02  [01x02_0.1in_th_straight_b_nom]  (value not drawn)
JP102  01x02  [01x02_0.1in_th_straight_b_nom]  (value not drawn)
JP103  01x02  [01x02_0.1in_th_straight_b_nom]  (value not drawn)
JP104  01x02  [01x02_0.1in_th_straight_b_nom]  (value not drawn)
JP105  01x02  [01x02_0.1in_th_straight_b_nom]  (value not drawn)
MH1  MH_7.4MMC_3.2MMD  [MH_7.4MMD_3.2MMD]  (value not drawn)  (no BOM)
MH2  MH_7.4MMC_3.2MMD  [MH_7.4MMD_3.2MMD]  (value not drawn)  (no BOM)
MH3  MH_7.4MMC_3.2MMD  [MH_7.4MMD_3.2MMD]  (value not drawn)  (no BOM)
MH4  MH_7.4MMC_3.2MMD  [MH_7.4MMD_3.2MMD]  (value not drawn)  (no BOM)
POWER1  PWR-2.1MM  [POWER2.1MM]
R1  500k  [R0805]
R2  500k  [R0805]
R3  500k  [R0805]
R4  500k  [R0805]
R5  500k  [R0805]
R6  500k  [R0805]
R7  500k  [R0805]
R8  500k  [R0805]
R9  500k  [R0805]
R10  500k  [R0805]
R11  500k  [R0805]
R12  500k  [R0805]
R13  500k  [R0805]
R14  500k  [R0805]
R15  500k  [R0805]
R16  500k  [R0805]
R17  500k  [R0805]
R18  500k  [R0805]
R19  500k  [R0805]
R20  500k  [R0805]
R21  500k  [R0805]
R22  500k  [R0805]
R23  500k  [R0805]
R24  500k  [R0805]
R25  500k  [R0805]
R26  500k  [R0805]
R27  500k  [R0805]
R28  500k  [R0805]
R29  500k  [R0805]
R30  500k  [R0805]
R31  500k  [R0805]
R32  500k  [R0805]
R33  500k  [R0805]
R34  500k  [R0805]
R35  500k  [R0805]
R36  500k  [R0805]
R37  500k  [R0805]
R38  500k  [R0805]
R39  500k  [R0805]
R40  500k  [R0805]
R41  500k  [R0805]
R42  500k  [R0805]
R43  500k  [R0805]
R44  500k  [R0805]
R45  500k  [R0805]
R46  500k  [R0805]
R47  500k  [R0805]
R48  500k  [R0805]
R49  500k  [R0805]
R50  500k  [R0805]
R51  500k  [R0805]
R52  500k  [R0805]
R53  500k  [R0805]
R54  500k  [R0805]
R55  500k  [R0805]
R56  500k  [R0805]
R57  500k  [R0805]
R58  500k  [R0805]
R59  500k  [R0805]
R60  500k  [R0805]
R61  500k  [R0805]
R62  500k  [R0805]
R63  500k  [R0805]
R64  500k  [R0805]
R65  500k  [R0805]
R66  500k  [R0805]
R67  500k  [R0805]
R68  500k  [R0805]
R69  500k  [R0805]
R70  500k  [R0805]
R71  500k  [R0805]
R72  500k  [R0805]
R73  500k  [R0805]
R74  500k  [R0805]
R75  500k  [R0805]
R76  500k  [R0805]
R77  500k  [R0805]
R78  500k  [R0805]
R79  500k  [R0805]
R80  500k  [R0805]
R81  500k  [R0805]
R82  500k  [R0805]
R83  500k  [R0805]
R84  500k  [R0805]
R85  500k  [R0805]
R86  500k  [R0805]
R87  500k  [R0805]
R88  500k  [R0805]
R89  500k  [R0805]
R90  500k  [R0805]
R91  500k  [R0805]
R92  500k  [R0805]
R93  500k  [R0805]
R94  500k  [R0805]
R95  500k  [R0805]
R96  500k  [R0805]
R97  500k  [R0805]
R98  500k  [R0805]
R99  500k  [R0805]
R100  500k  [R0805]
R101  500k  [R0805]
R102  500k  [R0805]
R103  500k  [R0805]
R104  500k  [R0805]
S1  SW-SPST  [SPST-2]
TP1  Testing_Port  [Testing_point]  (value not drawn)

## Sub-sheets
12V_2_5V_1 = 12V_to_5V.SchDoc: VDD_12V_in, VOUT_5V, GND
12V_2_5V_2 = 12V_to_5V.SchDoc: VDD_12V_in, VOUT_5V, GND
12V_2_5V_3 = 12V_to_5V.SchDoc: VDD_12V_in, VOUT_5V, GND
12V_2_5V_4 = 12V_to_5V.SchDoc: VDD_12V_in, VOUT_5V, GND
ad7606 = AD7606.SchDoc: V6, D8, D6, AVDD, VDRIVE, V3, V4, RESET, ~{WR}, REFIN/REFOUT, D14, D11, BUSY, RANGE, D2, V8, VREF, FRSTDATA, V5, D13, D15, D4, D9, D12, D7, REFSELECT, ~{PAR}/SER/BYTESEL, ~{STBY}, OS1, OS0, CONVST, D3, OS2, D1, D10, V7, V1, D5, V2, GND, D0, ~{RD}/SCLK, ~{CS}
ADC_4CH_1 = LTC2325.SchDoc: ~{CLKEN}, SDO3, VDD_ADC, Vin1, SDO1, SDO4, VREF, Vin4, SDO2, GND, VDD_IO_ADC, CLKOUT, Vin3, Vin2, ~{CN}V, SCK
ADC_4CH_2 = LTC2325.SchDoc: ~{CLKEN}, SDO3, VDD_ADC, Vin1, SDO1, SDO4, VREF, Vin4, SDO2, GND, VDD_IO_ADC, CLKOUT, Vin3, Vin2, ~{CN}V, SCK
ADC_8CH_1 = LTC2320-16.SchDoc: Vin8, ~{CLKEN}, SDO1, SDO6, Vin7, Vin1, Vin6, SDO3, Vin3, ~{CNV}, CLKOUT, SDO4, GND, VDD_IO_ADC, Vin4, VREF, SDO8, Vin2, SDO7, SDO2, SCK, VDD_ADC, Vin5, SDO5
ADJ_LDO_1 = ADJ_LDO.SchDoc: GND, VOUT, 5V_IN
ADJ_LDO_2 = ADJ_LDO.SchDoc: GND, VOUT, 5V_IN
ADJ_LDO_3 = ADJ_LDO.SchDoc: GND, VOUT, 5V_IN
ADJ_LDO_4 = ADJ_LDO.SchDoc: GND, VOUT, 5V_IN
ADJ_LDO_5 = ADJ_LDO.SchDoc: GND, VOUT, 5V_IN
ADJ_LDO_6 = ADJ_LDO.SchDoc: GND, VOUT, 5V_IN
ADJ_LDO_7 = ADJ_LDO.SchDoc: GND, VOUT, 5V_IN
ADJ_LDO_8 = ADJ_LDO.SchDoc: GND, VOUT, 5V_IN
ADJ_LDO_9 = ADJ_LDO.SchDoc: GND, VOUT, 5V_IN
ADJ_LDO_10 = ADJ_LDO.SchDoc: GND, VOUT, 5V_IN
ADJ_LDO_11 = ADJ_LDO.SchDoc: GND, VOUT, 5V_IN
BT_SW_MUX = ADC_DAC_SW_BT.SchDoc: GND, M24, M23, M22, M21, M20, M19, M18, M17, M16, M15, M14, M13, M12, M11, M10, M9, M8, M7, M6, M5, M4, M3, M2, M1, M24B, M24A, M23B, M23A, M22B, M22A, M21B, M21A, M20B, M20A, M19B, M19A, M18B, M18A, M17B, M17A, M16B, M16A, M15B, M15A, M14B, M14A, M13B, M13A, M12B, M12A, M11B, M11A, M2A, M4B, M1B, M4A, M2B, M1A, M3B, M5B, M6A, M6B, M7A, M7B, M8A, M8B, M9A, M9B, M10A, DIN3, DIN2, SCLK, M5A, M3A, ~{SYNC}, ~{RESET}, DIN1, M10B, VDD
DAC3 = AD5679.SchDoc: VOUT12, VOUT8, VOUT11, VOUT6, VOUT5, VOUT10, VOUT14, VOUT15, VLOGIC, VDD, ~{SYNC}, ~{LDAC}, ~{RESET}, SCLK, SDI, VREF, SDO, VOUT7, VOUT9, VOUT13, VOUT4, VOUT3, VOUT2, VOUT1, VOUT0, GND, GAIN
DAC5 = AD5679.SchDoc: VOUT12, VOUT8, VOUT11, VOUT6, VOUT5, VOUT10, VOUT14, VOUT15, VLOGIC, VDD, ~{SYNC}, ~{LDAC}, ~{RESET}, SCLK, SDI, VREF, SDO, VOUT7, VOUT9, VOUT13, VOUT4, VOUT3, VOUT2, VOUT1, VOUT0, GND, GAIN
DAC80508Z1 = DAC80508.SchDoc: ~{CS} (in), SDO (out), VREF (bidir), SCLK (in), SDI (in), VDD_DAC, OUT7 (out), GND, OUT4 (out), VIO_DAC, OUT0 (out), OUT1 (out), OUT6 (out), OUT5 (out), OUT2 (out), OUT3 (out)
DAC80508Z2 = DAC80508.SchDoc: ~{CS} (in), SDO (out), VREF (bidir), SCLK (in), SDI (in), VDD_DAC, OUT7 (out), GND, OUT4 (out), VIO_DAC, OUT0 (out), OUT1 (out), OUT6 (out), OUT5 (out), OUT2 (out), OUT3 (out)
DAC80508Z4 = DAC80508.SchDoc: ~{CS} (in), SDO (out), VREF (bidir), SCLK (in), SDI (in), VDD_DAC, OUT7 (out), GND, OUT4 (out), VIO_DAC, OUT0 (out), OUT1 (out), OUT6 (out), OUT5 (out), OUT2 (out), OUT3 (out)
DAC_SW_MUX = DAC_SW_LEFT.SchDoc: CH128, CH127, CH126, CH125, CH124, CH123, CH122, CH121, DIN16, IN32, IN31, DIN15, IN30, IN29, DIN11, IN22, IN21, DIN7, IN13, DIN10, IN20, IN19, DIN6, IN12, IN11, DIN9, IN18, IN17, DIN5, IN10, IN9, DIN4, IN8, IN7, DIN3, IN6, IN5, DIN2, IN4, IN3, CH8, CH7, CH3, CH2, CH6, CH5, GND, VDD, CH4, CH1, ~{SYNC}, SCLK, ~{RESET}, DIN1, IN2, IN1, CH120, CH119, CH118, CH117, CH116, CH115, CH114, CH113, CH112, CH111, CH110, CH109, CH108, CH107, CH106, CH105, CH104, CH103, CH102, CH101, CH100, CH99, CH98, CH97, CH96, CH95, CH94, CH93, CH92, CH91, CH90, CH89, CH88, CH87, CH86, CH85, CH84, CH83, CH82, CH81, CH80, CH79, CH78, CH77, CH76, CH75, CH74, CH73, CH72, CH71, CH70, CH69, CH68, CH67, CH66, CH65, CH64, CH63, CH62, CH61, CH60, CH59, CH58, CH57, CH56, CH55, CH54, CH53, CH52, CH51, CH50, CH49, CH48, CH47, CH46, CH45, CH44, CH43, CH42, CH41, CH40, CH39, CH38, CH37, CH36, CH35, CH34, CH33, CH32, CH31, CH30, CH29, CH28, CH27, CH26, CH25, CH24, CH23, CH22, CH21, CH20, CH19, CH18, CH17, CH16, CH15, CH14, CH13, CH12, CH11, CH10, CH9, DIN14, IN28, IN27, DIN13, IN26, IN25, DIN12, IN24, IN23, DIN8, IN16, IN15, IN14
levelShifter1 = 74LVC8T245.SchDoc: OUT6, OUT2, OUT5, IN8, IN7, OUT4, OUT8, GND, VCCB, VCCA, OUT1, OUT3, OUT7, IN6, IN5, IN4, IN3, IN2, IN1
levelShifter2 = 74LVC8T245.SchDoc: OUT6, OUT2, OUT5, IN8, IN7, OUT4, OUT8, GND, VCCB, VCCA, OUT1, OUT3, OUT7, IN6, IN5, IN4, IN3, IN2, IN1
levelShifter3 = 74LVC8T245.SchDoc: OUT6, OUT2, OUT5, IN8, IN7, OUT4, OUT8, GND, VCCB, VCCA, OUT1, OUT3, OUT7, IN6, IN5, IN4, IN3, IN2, IN1
levelShifter4 = 74LVC8T245.SchDoc: OUT6, OUT2, OUT5, IN8, IN7, OUT4, OUT8, GND, VCCB, VCCA, OUT1, OUT3, OUT7, IN6, IN5, IN4, IN3, IN2, IN1
levelShifter5 = 74LVC8T245.SchDoc: OUT6, OUT2, OUT5, IN8, IN7, OUT4, OUT8, GND, VCCB, VCCA, OUT1, OUT3, OUT7, IN6, IN5, IN4, IN3, IN2, IN1
levelShifter6 = 74LVC8T245.SchDoc: OUT6, OUT2, OUT5, IN8, IN7, OUT4, OUT8, GND, VCCB, VCCA, OUT1, OUT3, OUT7, IN6, IN5, IN4, IN3, IN2, IN1
levelShifter7 = 74LVC8T245.SchDoc: OUT6, OUT2, OUT5, IN8, IN7, OUT4, OUT8, GND, VCCB, VCCA, OUT1, OUT3, OUT7, IN6, IN5, IN4, IN3, IN2, IN1
SerDes1 = MCO23S17.SchDoc: ADDR6, ADDR5, ADDR4, SO2, SI2, ADDR2, ADDR1, ~{RST}, SI1, SCLK, ADDR3, VDD, ~{CS}, GND, SO1, Select32, Select31, Select30, Select29, Select28, Select27, Select26, Select25, Select24, Select23, Select22, Select21, Select20, Select19, Select18, Select17, Select16, Select15, Select14, Select13, Select12, Select11, Select10, Select9, Select8, Select7, Select6, Select5, Select4, Select3, Select2, Select1
TIA1 = TIA.SchDoc: VOUT4, VDD_TIA, INI4, VOUT1, VOUT3, INI2, GND, INI3, VOUT2, INI1, VREF
TIA2 = TIA.SchDoc: VOUT4, VDD_TIA, INI4, VOUT1, VOUT3, INI2, GND, INI3, VOUT2, INI1, VREF
TIA3 = TIA.SchDoc: VOUT4, VDD_TIA, INI4, VOUT1, VOUT3, INI2, GND, INI3, VOUT2, INI1, VREF
TIA4 = TIA.SchDoc: VOUT4, VDD_TIA, INI4, VOUT1, VOUT3, INI2, GND, INI3, VOUT2, INI1, VREF
TIA5 = TIA.SchDoc: VOUT4, VDD_TIA, INI4, VOUT1, VOUT3, INI2, GND, INI3, VOUT2, INI1, VREF
TIA6 = TIA.SchDoc: VOUT4, VDD_TIA, INI4, VOUT1, VOUT3, INI2, GND, INI3, VOUT2, INI1, VREF